# Altium project ESP32-DCU-Rev1.PrjPcb (part 1 of 2)
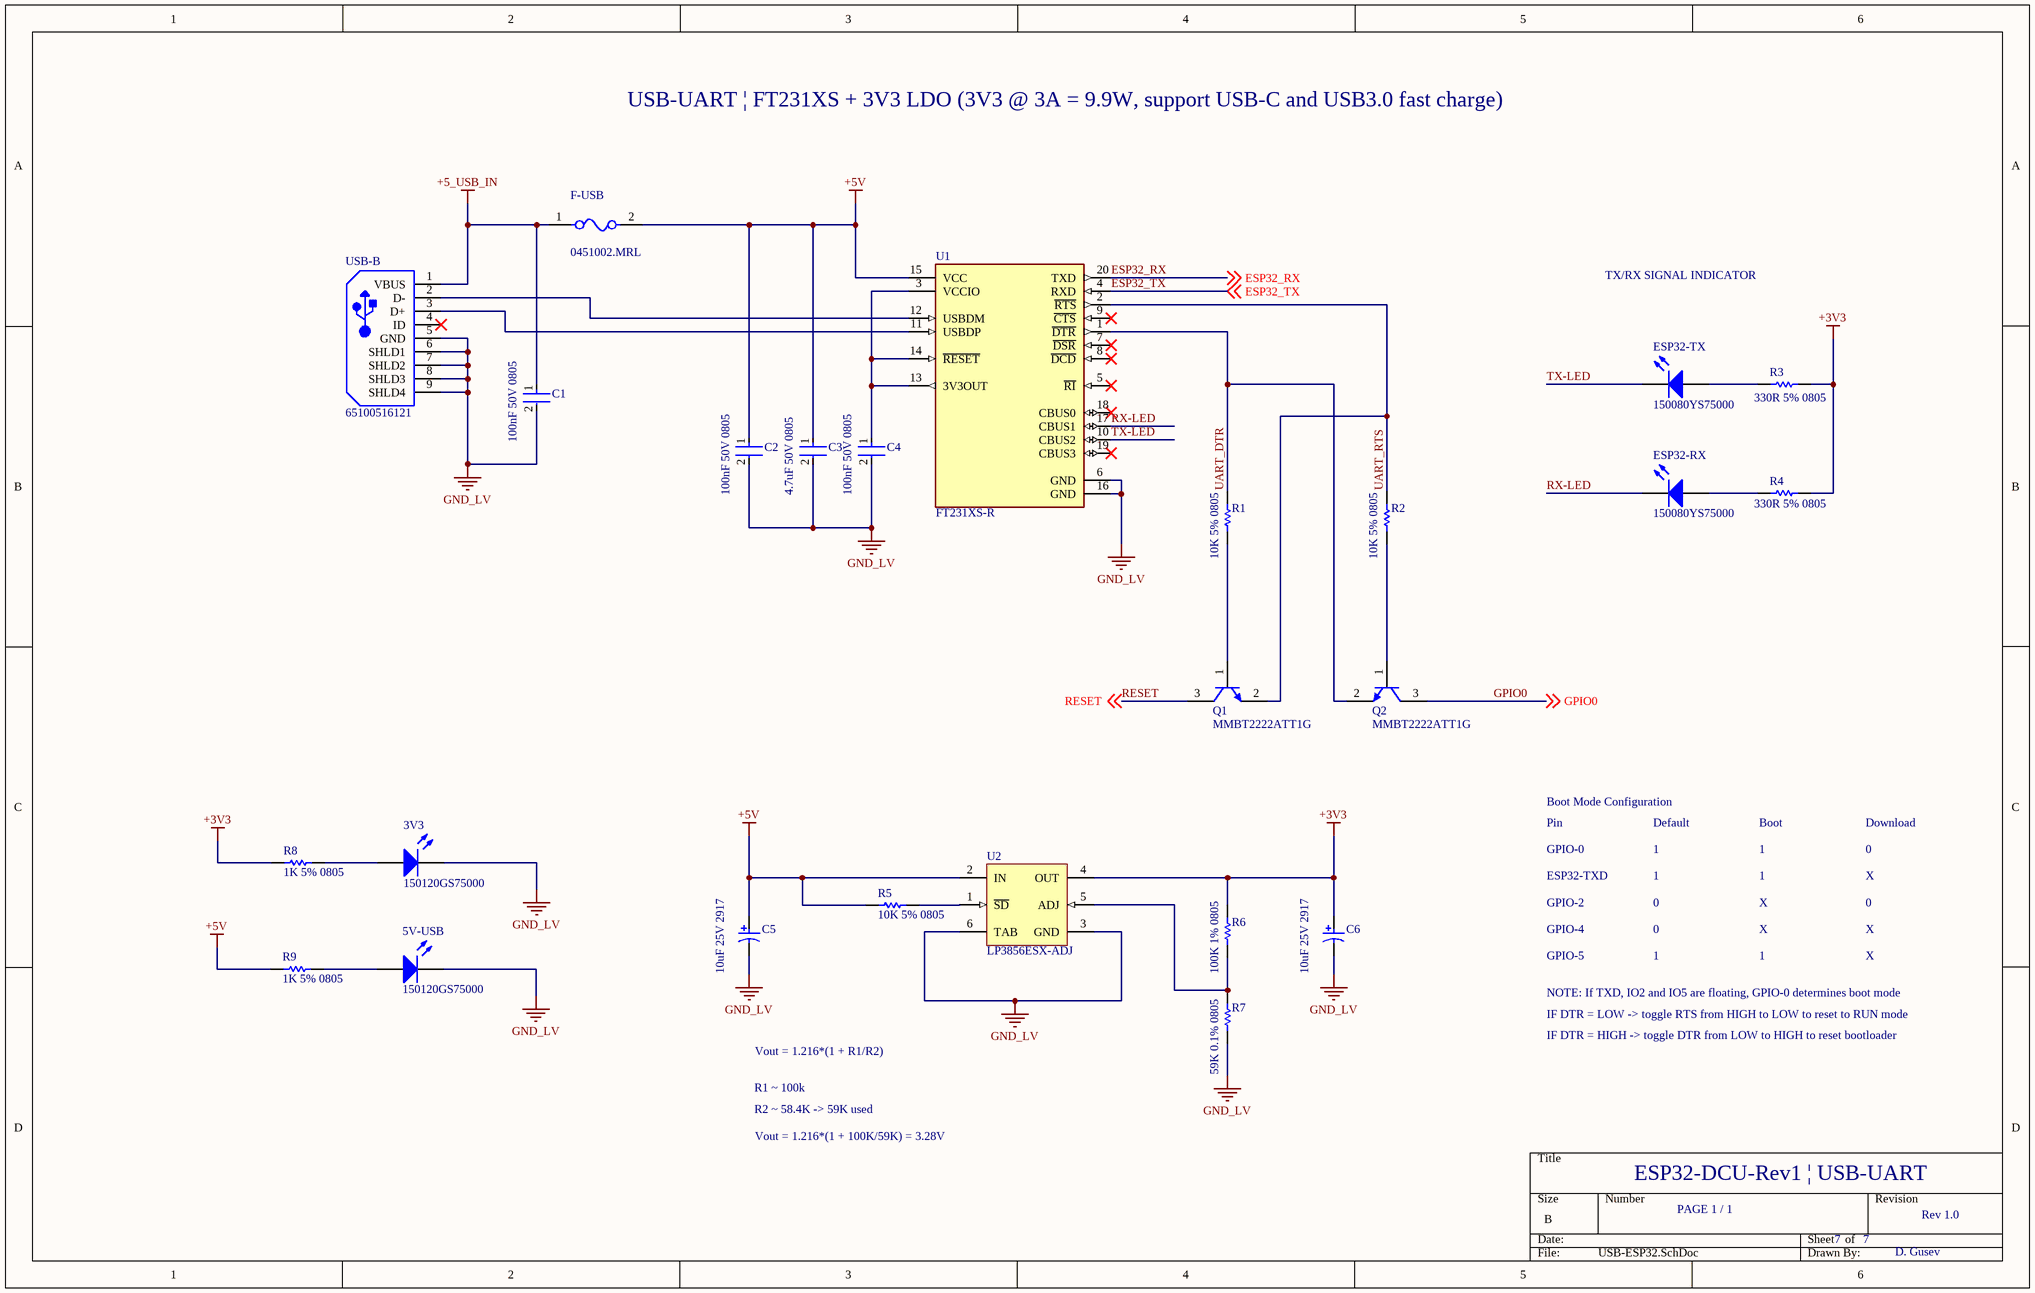
[diagram p0: USB-ESP32.SchDoc]
10 sheets, 162 parts. Net scope: global (net labels, ports and power ports of the same name join across sheets).
Sheets:
  USB-ESP32.SchDoc
  ESP32.SchDoc
  USB-HOST.SchDoc
  Ethernet.SchDoc
  MCP23017.SchDoc
  TCA9548A.SchDoc
  DCU1.SchDoc
  RELAYS.SchDoc
  POWER.SchDoc
  CONN.SchDoc

## Sheet USB-ESP32.SchDoc
size B

### Parts
3V3  150120GS75000  [1206_A]
5V-USB  150120GS75000  [1206_A]
C1  100nF 50V 0805  [FP-C0805C-DN-MFG]
C2  100nF 50V 0805  [FP-C0805C-DN-MFG]
C3  4.7uF 50V 0805  [FP-C2012-125-MFG]
C4  100nF 50V 0805  [FP-C0805C-DN-MFG]
C5  10uF 25V 2917  [KEMT-T491-D_L]
C6  10uF 25V 2917  [KEMT-T491-D_L]
ESP32-RX  150080YS75000  [0805_A]
ESP32-TX  150080YS75000  [0805_A]
F-USB  0451002.MRL  [FP-0451-MFG]
Q1  MMBT2222ATT1G  [ONSC-SC-75-3-463-01_V]
Q2  MMBT2222ATT1G  [ONSC-SC-75-3-463-01_V]
R1  10K 5% 0805  [RESC2013X60X40ML20T25]
R2  10K 5% 0805  [RESC2013X60X40ML20T25]
R3  330R 5% 0805  [RESC2013X60X40ML20T25]
R4  330R 5% 0805  [RESC2013X60X40ML20T25]
R5  10K 5% 0805  [RESC2013X60X40ML20T25]
R6  100K 1% 0805  [RESC2013X60X35ML10T20]
R7  59K 0.1% 0805  [RESC2013X60X35NL10T20]
R8  1K 5% 0805  [RESC2013X60X40ML20T25]
R9  1K 5% 0805  [RESC2013X60X40ML20T25]
U1  FT231XS-R  [FP-SSOP-20-MFG]
U2  LP3856ESX-ADJ  [TS5B_M]
USB-B  65100516121  [WE-65100516121_V]

### Nets
+3V3: C6.1 R3.1 R4.1 R6.2 R8.2 U2.4(OUT)  [project net VDD33]
+5_USB_IN: C1.1 F-USB.1 USB-B.1(VBUS)
+5V: C2.1 C3.1 C5.1 F-USB.2 R5.2 R9.2 U1.15(VCC) U2.2(IN)
GND_LV: 3V3.1(K) 5V-USB.1(K) C1.2 C2.2 C3.2 C4.2 C5.2 C6.2 R7.1 U1.6(GND) U1.16(GND) U2.3(GND) U2.6(TAB) USB-B.5(GND) USB-B.6(SHLD1) USB-B.7(SHLD2) USB-B.8(SHLD3) USB-B.9(SHLD4)
ESP32_RX: U1.20(TXD) ; off-sheet ESP32_RX
ESP32_TX: U1.4(RXD) ; off-sheet ESP32_TX
GPIO0: Q2.3(C) ; off-sheet GPIO0
RESET: Q1.3(C) ; off-sheet RESET
RX-LED: ESP32-RX.1(K) U1.17(CBUS1)
TX-LED: ESP32-TX.1(K) U1.10(CBUS2)
UART_DTR: Q2.2(E) R1.2 U1.1(~{DTR})
UART_RTS: Q1.2(E) R2.2 U1.2(~{RTS})
Net3V3_2: 3V3.2(A) R8.1
Net5V-USB_2: 5V-USB.2(A) R9.1
NetC4_1: C4.1 U1.3(VCCIO) U1.13(3V3OUT) U1.14(~{RESET})
NetESP32-RX_2: ESP32-RX.2(A) R4.2
NetESP32-TX_2: ESP32-TX.2(A) R3.2
NetQ1_1: Q1.1(B) R1.1
NetQ2_1: Q2.1(B) R2.1
NetR5_1: R5.1 U2.1(~{SD})
NetR6_1: R6.1 R7.2 U2.5(ADJ)
NetU1_11: U1.11(USBDP) USB-B.3(D+)
NetU1_12: U1.12(USBDM) USB-B.2(D-)

Not connected (* = marked no-connect by the designer): U1 5(~{RI})* 7(~{DSR})* 8(~{DCD})* 9(~{CTS})* 18(CBUS0)* 19(CBUS3)*; USB-B 4(ID)*

### Notes on the sheet
- USB-UART | FT231XS + 3V3 LDO (3V3 @ 3A = 9.9W, support USB-C and USB3.0 fast charge)
- TX/RX SIGNAL INDICATOR
- Boot Mode Configuration
- Pin
- Default
- Boot
- Download
- GPIO-0
- ESP32-TXD
- GPIO-2
- 1
- 0
- X
- GPIO-4
- GPIO-5
- NOTE: If TXD, IO2 and IO5 are floating, GPIO-0 determines boot mode
- IF DTR = LOW -> toggle RTS from HIGH to LOW to reset to RUN mode
- IF DTR = HIGH -> toggle DTR from LOW to HIGH to reset bootloader
- R1 ~ 100k
- R2 ~ 58.4K -> 59K used
- Vout = 1.216*(1 + R1/R2)
- Vout = 1.216*(1 + 100K/59K) = 3.28V
- ESP32-DCU-Rev1 | USB-UART
- PAGE 1 / 1
- 7
- Rev 1.0
- D. Gusev

### Library data of the parts
3V3 5V-USB = CMP-1426-00014-1: SMD mono-color Chip LED, WL-SMCW, Green; Manufacturer: Wuerth Elektronik; PackageReference: 1206_A; PartNumber: 150120GS75000; ComponentLink1Description: Manufacturer URL; ComponentLink2URL: http://katalog.we-online.com/led/datasheet/150120GS75000.pdf; ComponentLink2Description: Datasheet; Color: Green; ComponentLink1URL: http://www.we-online.com
C1 C2 C4 = CMP-2007-00279-2: CAP CER 0.1UF 50V X7R 0805; Manufacturer Part Number: C0805C104K5RACTU; Manufacturer: KEMET; Value: 0.10 μF; Tolerance: 0.1; Temperature Coefficient: 30ppm/°C; Material: Ceramic; Device Class L2: Capacitors; Temperature Range Low: -55°C; Voltage Rating: 50 V; Digikey Description: CAP CER 0.1UF 50V X7R 0805; Category: Cap; ComponentLink2Description: Datasheet; Octopart: https://octopart.com/c0805c104k5ractu-kemet-143926; RoHS: TRUE; ComponentLink2URL: https://content.kemet.com/datasheets/KEM_C1003_C0G_SMD.pdf; Temperature Characteristic: X7R; Temperature: -55°C to +125°C; Height: 0.88mm; Temperature Range High: +125°C; Device Class L1: Passive Components; Automotive: No; Lead Free: Yes; Ipc Land Pattern Name: CAPC200125X78; Device Class L3: Ceramic Capacitors; Mouser Description: Cap Ceramic 0.1uF 50V X7R 10% SMD 2.0 x 1.2 mm 125 C Paper T/R; Capacitance: 0.10 μF; Package: C0805C-DN
C3 = CMP-08246-000007-1: CAP CER 4.7UF 50V X5R 0805; Manufacturer Part Number: C2012X5R1H475K125AB; Manufacturer: TDK Corporation; Tolerance: 10%; Temperature Coefficient: 15%; Material: Ceramic; Mouser Description: Multilayer Ceramic Capacitors MLCC - SMD/SMT 0805 4.7uF 50volts X5R 10%; Category: Cap; Temperature Range High: +85°C; Digikey Description: CAP CER 4.7UF 50V X5R 0805; Voltage Rating: 50V; Device Class L1: Passive Components; Temperature Range Low: -55°C; Lead Free: Yes; ComponentLink2Description: Datasheet; Capacitance: 4.7uF; Octopart: https://octopart.com/c2012x5r1h475k125ab-tdk-25947720; Device Class L2: Capacitors; Value: 4.7uF; Temperature: -55°C to +85°C; ComponentLink2URL: https://product.tdk.com/info/en/catalog/datasheets/mlcc_commercial_general_en.pdf; RoHS: TRUE; Height: 1.45mm; Temperature Characteristic: X5R; Package: C2012-125; Device Class L3: Ceramic Capacitors; Automotive: No
C5 C6 = CMP-2000-07200-1: Tantalum Capacitor, 10 uF, +/- 10%, 25 V, -55 to 125 degC, 2-Pin SMD, RoHS, Tape and Reel; Manufacturer: Kemet; Insulation: NotRequired; Rad Hardened: No; Case Style: Molded; Polarity: Polar; Product Height (mm): 2.8mm; Capacitance: 10000000pF; Product Length (mm): 7.3mm; DF: 6%; ESR: 1ohm; Product Diameter (mm): NotRequiredmm; Voltage: 25VDC; Product Depth (mm): 4.3mm; DCL: 2.5uA; Mounting Style: SurfaceMount; Construction: SMTChip; Failure Rate: NotRequired; Operating Temp Range: -55Cto125C; Packaging: TapeandReel; Length W/Weld: NotRequiredmm; Package Reference: T491-D; Datasheet Version: 10/2016; Package / Case: 7343-31; Wire Form: NotRequired; Seated Plane Height: NotRequiredmm; Length W/Weld (max): NotRequiredmm; Package Description: 2-Pin Surface Mount Device, Body 7.3 x 4.3 mm; Tolerance (+ or -): 10%; Manufacturer URL: http://www.kemet.com/; Datasheet URL: http://capacitoredge.kemet.com/capedge2/DataSheet/Datasheet-T491D106K025AT.pdf?pn=T491D106K025AT; Case Code: D; Mounting Technology: SurfaceMount; Seal: NotRequired; Lead Spacing (nom): NotRequiredmm
ESP32-RX ESP32-TX = CMP-1426-00012-1: SMD mono-color Chip LED, WL-SMCW, Yellow; Manufacturer: Wuerth Elektronik; Color: Yellow; ComponentLink1URL: http://www.we-online.com; PackageReference: 0805_A; ComponentLink2URL: http://katalog.we-online.com/led/datasheet/150080YS75000.pdf; ComponentLink1Description: Manufacturer URL; ComponentLink2Description: Datasheet; PartNumber: 150080YS75000
F-USB = CMP-08605-000053-1: FUSE BOARD MNT 2A 125VAC/VDC SMD; Manufacturer: Littelfuse; Max Fuse Dc Voltage: 125V; Value: 0.0367Ω; Fuse Interrupt Ac Current: 50A; Fuse I2T: 0.53A2Sec; Fuse Blow Speed: Fast; Device Class L2: Fuses; Temperature Range High: +125°C; Category: Fuse; ComponentLink2URL: https://www.littelfuse.com/~/media/electronics/datasheets/fuses/littelfuse_fuse_451_453_datasheet.pdf.pdf; Automotive: No; Temperature Range Low: -55°C; Voltage Rating: 125V; ComponentLink2Description: Datasheet; Temperature: -55°C to +125°C; Device Class L3: unset; Height: 2.94mm; Lead Free: Yes; Resistance: 0.0367Ω; Max Fuse Ac Voltage: 125V; Fuse Interrupt Dc Current: 50A; RoHS: TRUE; Fuse Current: 2A; Digikey Description: FUSE BOARD MNT 2A 125VAC/VDC SMD; Device Class L1: Circuit Protection; Octopart: https://octopart.com/0451002.mrl-littelfuse-566376; Mouser Description: Surface Mount Fuses 125V 2A; Package: 0451; Manufacturer Part Number: 0451002.MRL
Q1 Q2 = CMP-1048-00417-1: General Purpose Transistor, NPN Silicon, 3-Pin SC-75, Pb-Free, Tape and Reel; Manufacturer: On Semiconductor; IC Continuous (A): 0.6; fT Min (MHz): 300; DatasheetVersion: Rev. 5; PackageVersion: Rev. F, 07/2005; ComponentLink1Description: Manufacturer URL; RoHS: TRUE; Packing: Tape and Reel; ComponentLink3URL: http://www.onsemi.com/pub_link/Collateral/463-01.PDF; ComponentLink1URL: http://www.onsemi.com/; ComponentLink3Description: Package Specification; ComponentLink2URL: http://www.onsemi.cn/pub_link/Collateral/MMBT2222ATT1-D.PDF; Mounting Technology: Surface Mount; PartNumber: MMBT2222ATT1G; ComponentLink2Description: Datasheet; Polarity: NPN; PackageReference: SC-75-3-463-01; PackageDescription: 3-Pin Small Outline Transistor, Body 1.6 x 0.8 mm, Pitch 0.5 mm
R1-R5 R8 R9 = CMP-2001-00590-1: Part Number: ERA6AEB123V; Manufacturer: Panasonic
R6 = CMP-2100-03668-1: Chip Resistor, 100 KOhm, +/- 1%, 0.125 W, -55 to 155 degC, 0805 (2012 Metric), RoHS, Tape and Reel; Manufacturer: Yageo; Max Power Dissipation: 125mW; Voltage Rating: 150V; Temperature Coefficient: 100ppm/degreesC; Manufacturer URL: http://www.yageo.com/; Min Operating Temperature: -55degC; Lead Pitch: 0.4mm; Composition: ThickFilm; Case Code (Metric): 2012; Military Standard: Not; Package Description: 2-Pin Surface Mounted Device, Body 2 x 1.25 mm; REACH SVHC: Unknown; RoHSCompliant: true; Depth: 1.25mm; Number of Pins: 2; Lead Free: LeadFree; Resistance: 100KOhm; Datasheet URL: http://www.yageo.com/NewPortal/yageodocoutput?fileName=/pdf/R-Chip/PYu-RC_Group_51_RoHS_L_5.pdf; Max Operating Temperature: 155degC; Case/Package: 0805; Package Quantity: 1; Case Code (Imperial): 0805; Power Rating: 125mW; Width: 0.049inch; Package Reference: 0805; Height: 0.024inch; Termination: SMD/SMT; Tolerance: 1%; Datasheet Version: Rev. 5, 10/2016; Length: 2mm; Voltage Rating (DC): 150V; Number of Terminations: 2; Packaging: TapeandReel
R7 = CMP-2001-01205-1: Part Number: RC0805FR-0759KL; Manufacturer: Yageo
U1 = CMP-0248-00024-3: IC USB SERIAL FULL UART 20SSOP; Operating Supply Voltage: 5V; Operating Supply Current: 8mA; Number of Channels: 1; Min Supply Voltage: 2.97V; Max Supply Voltage: 5.5V; Data Rate: 12Mbps; Height: 0.059inch; Packaging: Tape and Reel; Mount: Surface Mount; Package Quantity: 2000; Radiation Hardening: No; Case/Package: SSOP; Min Operating Temperature: -40°C; Width: 0.157inch; Number of Pins: 20; Weight: 0.016oz; Interface: UART; Max Operating Temperature: 85°C; Length: 8.74mm
U2 = CMP-0062-00133-2: 3A Fast Ultra Low Dropout Linear Regulator, 5-pin TO-263; Manufacturer: National Semiconductor; PackageTopMarking: NSUZXYTTE#*LP3856ES*-ADJ; PowerWise: N; CompType: LDO IC; PackageDescription: TO-263, Molded, .400 x .390 x .180in, 5 Lead, .067in Pitch, Surface Mount; RevisionNote: Component URLs added; ComponentLink1URL: http://www.national.com/ds/LP/LP3856-ADJ.pdf; PinCount: 5; ComponentLink2URL: http://www.national.com/pf/LP/LP3856.html; Code_JEDEC: MO-169-AB; PackageVersion: revD, Apr-2005; PackageReference: TS5B; DatasheetVersion: Sep-2006; ComponentLink1Description: LP3856 Datasheet; ComponentLink3Description: TS5B Package Page; ComponentLink3URL: http://www.national.com/packaging/folders/ts5b.html; ComponentLink2Description: LP3856 Web Page; RoHS: N
USB-B = CMP-2000-05576-1: MINI USB 2.0 SMT Type B 5 Contacts, 30 V, -40 to 105 degC, RoHS, Tape and Reel; Manufacturer: Wuerth Elektronik; Package Description: 5-Pin Surface Mount Device, Body 9.6 x 9.25 mm, Pitch 0.8 mm; Mounting Technology: SurfaceMount; Package Reference: 65100516121; Manufacturer URL: https://www.we-online.com/; Datasheet Version: Rev. H, 02/2013; Datasheet URL: https://datasheet.ciiva.com/4598/65100516121-83749-4598775.pdf

## Sheet ESP32.SchDoc
size B
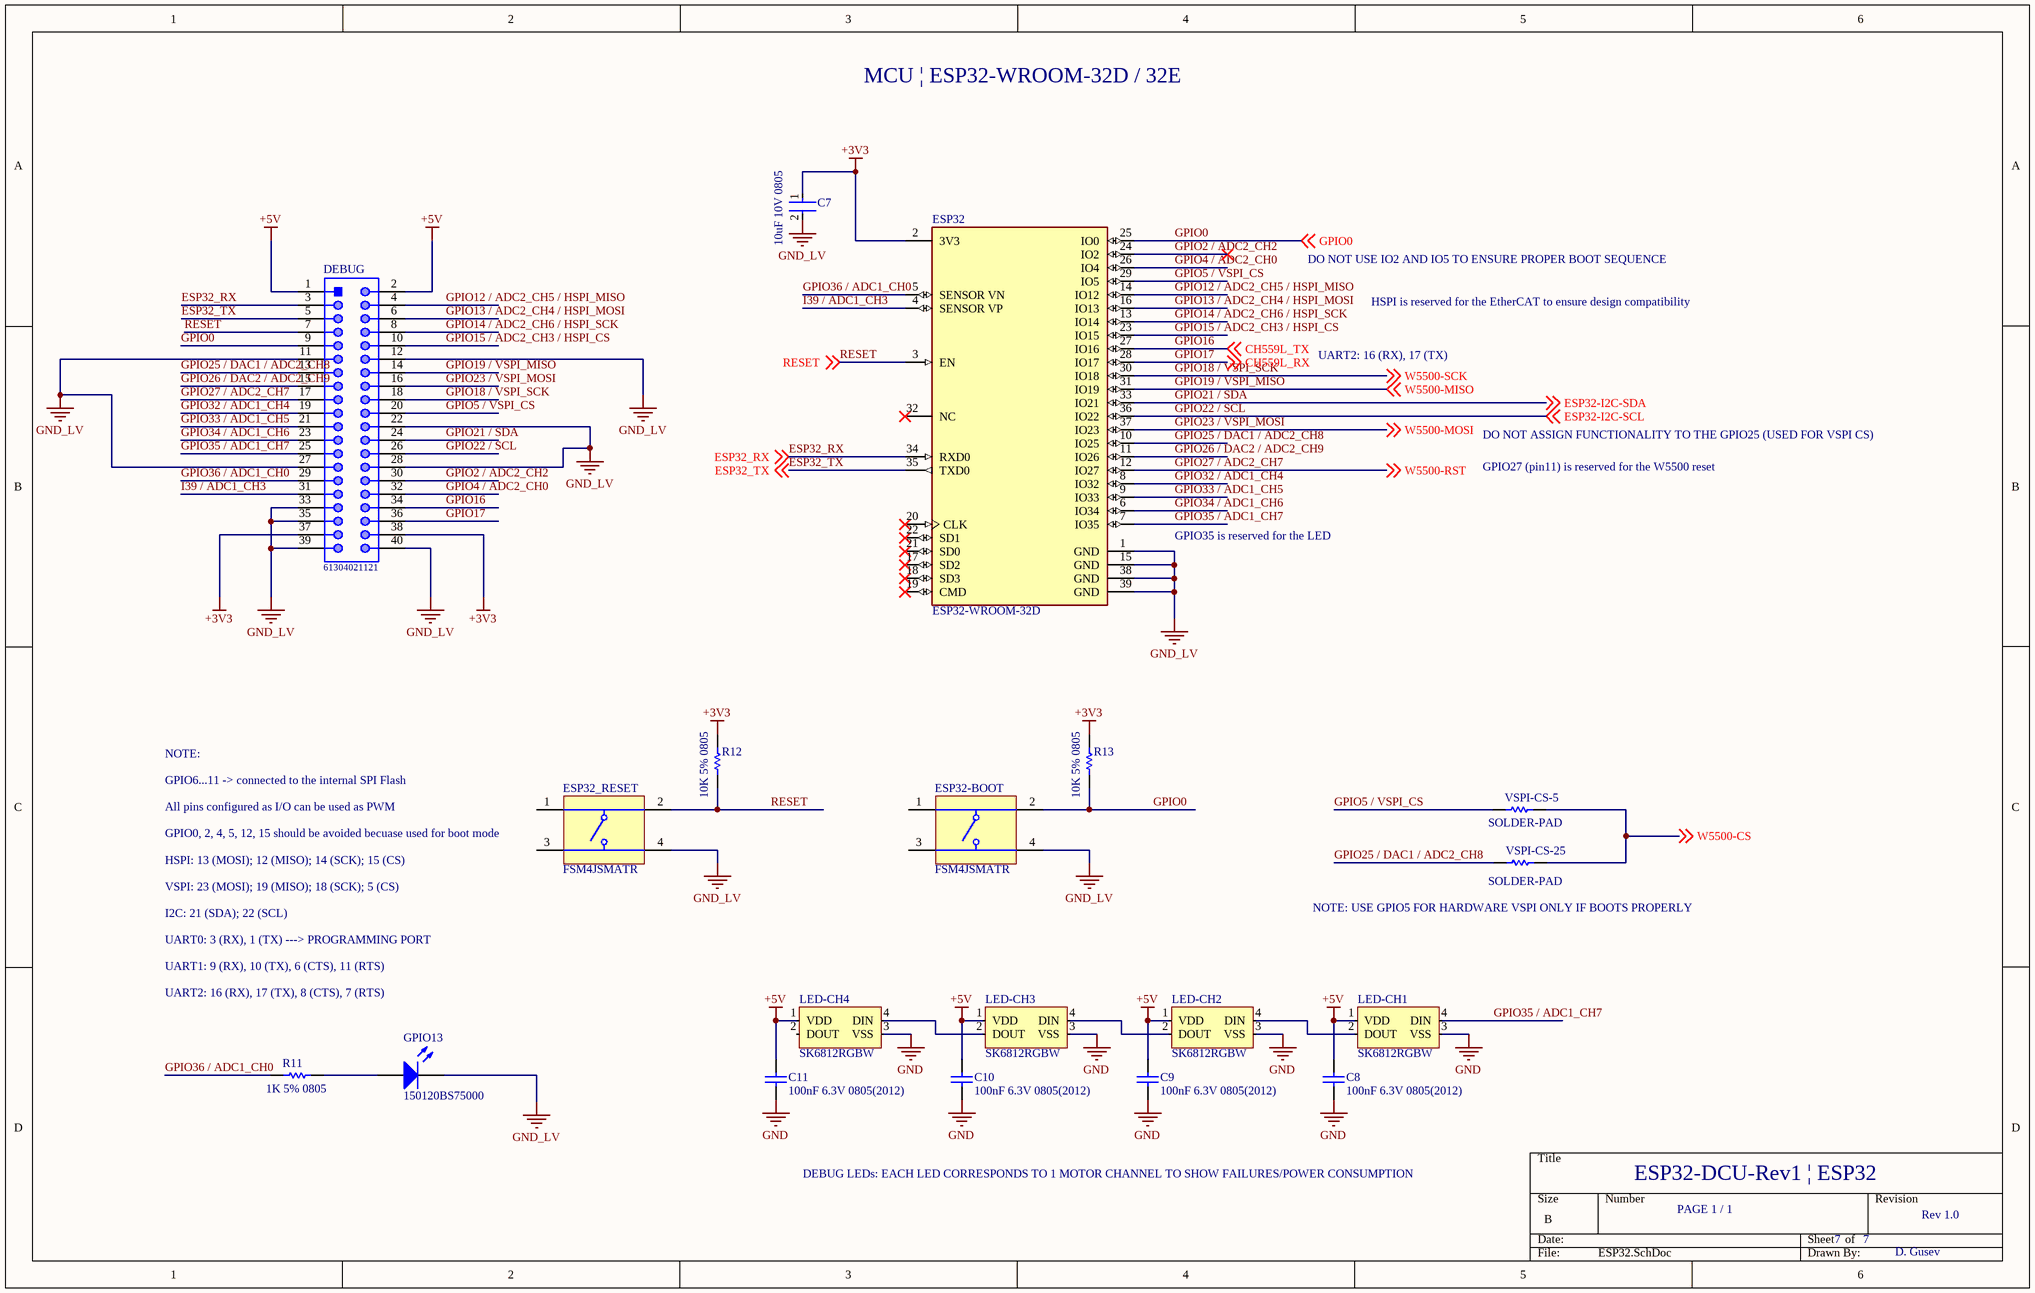
[diagram p1: ESP32.SchDoc]

### Parts
C7  10uF 10V 0805  [FP-C0805C-DG-MFG]
C8  100nF 6.3V 0805(2012)  [CAPC0805(2012)100_N]
C9  100nF 6.3V 0805(2012)  [CAPC0805(2012)100_N]
C10  100nF 6.3V 0805(2012)  [CAPC0805(2012)100_N]
C11  100nF 6.3V 0805(2012)  [CAPC0805(2012)100_N]
DEBUG  61304021121  [61304021121]
ESP32  ESP32-WROOM-32D  [FP-ESP32-WROOM-32D-MFG]
ESP32-BOOT  FSM4JSMATR  [TECO-FSM4JSMATR_V]
ESP32_RESET  FSM4JSMATR  [TECO-FSM4JSMATR_V]
GPIO13  150120BS75000  [1206_A]
LED-CH1  SK6812RGBW  [SK6812RGBW]
LED-CH2  SK6812RGBW  [SK6812RGBW]
LED-CH3  SK6812RGBW  [SK6812RGBW]
LED-CH4  SK6812RGBW  [SK6812RGBW]
R11  1K 5% 0805  [RESC2013X60X40ML20T25]
R12  10K 5% 0805  [RESC2013X60X40ML20T25]
R13  10K 5% 0805  [RESC2013X60X40ML20T25]
VSPI-CS-5  SOLDER-PAD  [RESC2013X60X35LL10T20]
VSPI-CS-25  SOLDER-PAD  [RESC2013X60X35LL10T20]

### Nets
+3V3: C7.1 DEBUG.37 DEBUG.38 ESP32.2(3V3) R12.2 R13.2  [project net VDD33]
+5V: C8.2 C9.2 C10.2 C11.2 DEBUG.1 DEBUG.2 LED-CH1.1(VDD) LED-CH2.1(VDD) LED-CH3.1(VDD) LED-CH4.1(VDD)
GND: C8.1 C9.1 C10.1 C11.1 LED-CH1.3(VSS) LED-CH2.3(VSS) LED-CH3.3(VSS) LED-CH4.3(VSS)
GND_LV: C7.2 DEBUG.11 DEBUG.12 DEBUG.22 DEBUG.27 DEBUG.28 DEBUG.33 DEBUG.35 DEBUG.39 DEBUG.40 ESP32.1(GND) ESP32.15(GND) ESP32.38(GND) ESP32.39(GND) ESP32-BOOT.4 ESP32_RESET.4 GPIO13.1(K)
ESP32_RX: DEBUG.3 ESP32.34(RXD0) ; off-sheet ESP32_RX
ESP32_TX: DEBUG.5 ESP32.35(TXD0) ; off-sheet ESP32_TX
GPIO0: DEBUG.9 ESP32.25(IO0) ESP32-BOOT.2 R13.1 ; off-sheet GPIO0
GPIO2 / ADC2_CH2: DEBUG.30 ESP32.24(IO2)
GPIO4 / ADC2_CH0: DEBUG.32 ESP32.26(IO4)
GPIO5 / VSPI_CS: DEBUG.20 ESP32.29(IO5) VSPI-CS-5.1
GPIO12 / ADC2_CH5 / HSPI_MISO: DEBUG.4 ESP32.14(IO12)
GPIO13 / ADC2_CH4 / HSPI_MOSI: DEBUG.6 ESP32.16(IO13)
GPIO14 / ADC2_CH6 / HSPI_SCK: DEBUG.8 ESP32.13(IO14)
GPIO15 / ADC2_CH3 / HSPI_CS: DEBUG.10 ESP32.23(IO15)
GPIO16: DEBUG.34 ESP32.27(IO16) ; off-sheet CH559L_TX  [also labelled CH559L_TX]
GPIO17: DEBUG.36 ESP32.28(IO17) ; off-sheet CH559L_RX  [also labelled CH559L_RX]
GPIO18 / VSPI_SCK: DEBUG.18 ESP32.30(IO18) ; off-sheet W5500-SCK  [also labelled W5500-SCK]
GPIO19 / VSPI_MISO: DEBUG.14 ESP32.31(IO19) ; off-sheet W5500-MISO  [also labelled W5500-MISO]
GPIO21 / SDA: DEBUG.24 ESP32.33(IO21) ; off-sheet ESP32-I2C-SDA  [also labelled ESP32-I2C-SDA]
GPIO22 / SCL: DEBUG.26 ESP32.36(IO22) ; off-sheet ESP32-I2C-SCL  [also labelled ESP32-I2C-SCL]
GPIO23~{ }/ VSPI_MOSI: DEBUG.16 ESP32.37(IO23) ; off-sheet W5500-MOSI  [also labelled W5500-MOSI]
GPIO25 / DAC1 / ADC2_CH8: DEBUG.13 ESP32.10(IO25) VSPI-CS-25.1
GPIO26 / DAC2 / ADC2_CH9: DEBUG.15 ESP32.11(IO26)
GPIO27 / ADC2_CH7: DEBUG.17 ESP32.12(IO27) ; off-sheet W5500-RST  [also labelled W5500-RST]
GPIO32 / ADC1_CH4: DEBUG.19 ESP32.8(IO32)
GPIO33 / ADC1_CH5: DEBUG.21 ESP32.9(IO33)
GPIO34 / ADC1_CH6: DEBUG.23 ESP32.6(IO34)
GPIO35 / ADC1_CH7: DEBUG.25 ESP32.7(IO35) LED-CH1.4(DIN)
GPIO36 / ADC1_CH0: DEBUG.29 ESP32.5(SENSOR_VN) R11.1
I39 / ADC1_CH3: DEBUG.31 ESP32.4(SENSOR_VP)
RESET: DEBUG.7 ESP32.3(EN) ESP32_RESET.2 R12.1 ; off-sheet RESET
W5500-CS: VSPI-CS-5.2 VSPI-CS-25.2 ; off-sheet W5500-CS  [project net SCSn]
NetGPIO13_2: GPIO13.2(A) R11.2
NetLED-CH1_2: LED-CH1.2(DOUT) LED-CH2.4(DIN)
NetLED-CH2_2: LED-CH2.2(DOUT) LED-CH3.4(DIN)
NetLED-CH3_2: LED-CH3.2(DOUT) LED-CH4.4(DIN)

Not connected (* = marked no-connect by the designer): ESP32 17(SD2)* 18(SD3)* 19(CMD)* 20(CLK)* 21(SD0)* 22(SD1)* 32(NC)*; ESP32-BOOT 1 3; ESP32_RESET 1 3; LED-CH4 2(DOUT)

### Notes on the sheet
- MCU | ESP32-WROOM-32D / 32E
- DO NOT USE IO2 AND IO5 TO ENSURE PROPER BOOT SEQUENCE
- UART2: 16 (RX), 17 (TX)
- HSPI is reserved for the EtherCAT to ensure design compatibility
- DO NOT ASSIGN FUNCTIONALITY TO THE GPIO25 (USED FOR VSPI CS)
- GPIO27 (pin11) is reserved for the W5500 reset
- GPIO35 is reserved for the LED
- NOTE:
- GPIO6...11 -> connected to the internal SPI Flash
- All pins configured as I/O can be used as PWM
- (near ESP32_RESET) GPIO0, 2, 4, 5, 12, 15 should be avoided becuase used for boot mode
- HSPI: 13 (MOSI); 12 (MISO); 14 (SCK); 15 (CS)
- VSPI: 23 (MOSI); 19 (MISO); 18 (SCK); 5 (CS)
- (near VSPI-CS-25) NOTE: USE GPIO5 FOR HARDWARE VSPI ONLY IF BOOTS PROPERLY
- I2C: 21 (SDA); 22 (SCL)
- UART0: 3 (RX), 1 (TX) ---> PROGRAMMING PORT
- UART1: 9 (RX), 10 (TX), 6 (CTS), 11 (RTS)
- UART2: 16 (RX), 17 (TX), 8 (CTS), 7 (RTS)
- DEBUG LEDs: EACH LED CORRESPONDS TO 1 MOTOR CHANNEL TO SHOW FAILURES/POWER CONSUMPTION
- ESP32-DCU-Rev1 | ESP32
- PAGE 1 / 1
- 7
- Rev 1.0
- D. Gusev

### Library data of the parts
C7 = CMP-2007-03243-2: CAP CER 10UF 10V X5R 0805; Manufacturer Part Number: C0805C106K8PACTU; Manufacturer: Kemet; 3DS Part Number: 220-00001; Tolerance: 10%; Temperature Coefficient: 15%; Material: Ceramic; Device Class L2: Capacitors; Device Class L1: Passive Components; ComponentLink2URL: https://content.kemet.com/datasheets/KEM_C1006_X5R_SMD.pdf; Height: 1.4mm; Lead Free: Yes; Digikey Description: CAP CER 10UF 10V X5R 0805; Octopart: https://octopart.com/c0805c106k8pactu-kemet-98697; Capacitance: 10uF; Value: 10uF; Temperature Range Low: -55°C; Temperature: -55°C to +85°C; Automotive: No; Mouser Description: CAP CER 10UF 10V X5R 0805; Ipc Land Pattern Name: CAPC200125X125; Temperature Range High: +85°C; Voltage: 10V; RoHS: TRUE; Device Class L3: Ceramic Capacitors; ComponentLink2Description: Datasheet; Voltage Rating: 10V; Package: C0805C-DG; Temperature Characteristic: X5R; Category: Cap
C8-C11 = CMP-1036-04392-1: CAP 100nF 6.3V ±20% 0805 (2012 Metric) Thickness 1mm SMD; Tolerance: Â±20%; Case-Metric: 2012; Case-EIA: 0805; Max Thickness: 1 mm; Technology: SMT; Value: 100nF; Rated Voltage: 6.3 V
DEBUG = CMP-1502-01135-1: THT Vertical Pin Header WR-PHD, Pitch 2.54 mm, Dual Row, 40 pins; Manufacturer: Wurth Elektronik; Contact Resistance: 20mOhm; Pitch: 2.54mm; Pin Number: 40; Withstanding Voltage: 500VAC; Gender: Male; Rated Current: 3A; Working Voltage: 250VAC; Operating Temperature: -40to105degC; Manufacturer URL: http://www.we-online.de; Orientation: Vertical; Datasheet URL: https://katalog.we-online.de/em/datasheet/6130xx21121.pdf; Package Reference: 61304021121; Row Number: Dual; Part Number: 61304021121; Packaging: Bag; Mounting Technology: THT; Publisher: WurthElektronik
ESP32 = CMP-194065-000003-1: WIFI MODULE 32MBITS SPI FLASH; Manufacturer: Espressif Systems; Max Supply Voltage: 3.6V; Nominal Supply Current: 500mA; Max Frequency: 2484MHz; Number Of Adc Channels: 16; Number Of Gpio: 32; Interface: I2C,SPI,UART,Ethernet,I2S,Other; Data Rate: 150Mbits/s; Min Supply Voltage: 3V; Bandwidth: 72MHz; Sensitivity: -98dBm; Octopart: https://octopart.com/esp32-wroom-32d-espressif+systems-91040050; Package: ESP32-WROOM-32D; ComponentLink2URL: https://www.espressif.com/sites/default/files/documentation/esp32-wroom-32d_esp32-wroom-32u_datasheet_en.pdf; Lead Free: Yes; Category: UNK; Mouser Description: Wi-Fi/BT BLE Module ESP32-D0WD, SPI Flash, UART, P; Device Class L1: Integrated Circuits (ICs); RoHS: TRUE; Temperature Range Low: -40°C; ComponentLink2Description: Datasheet; Digikey Description: WIFI MODULE 32MBITS SPI FLASH; Height: 3.2mm; Temperature: -40°C to +85°C; Manufacturer Part Number: ESP32-WROOM-32D; Device Class L3: Transceivers; Device Class L2: RF Semiconductors and Devices; Temperature Range High: +85°C; Automotive: No
ESP32-BOOT ESP32_RESET = CMP-2000-07486-1: Micro Miniature Push Button Switch FSM JSM, 50 mA, -35 to 85 degC, 4-Pin SMD, RoHS, Tape and Reel; Manufacturer: TE Connectivity; Mechanical Life: 100000Cycles; Current Rating: 50mA; Actuator Material: Polyamide; Max Voltage Rating (DC): 12V; Capacitance: 0f; Illumination Type: Illuminated; Voltage Rating (DC): 24V; Case\/Package: SMD/SMT; Operating Force: 160gf; Contact Resistance: 100mOhm; Actuator Length: 0.055inch; Switch Travel: 0.25mm; Throw Configuration: SPST; Termination: GullWing; Contact Plating: Silver; Orientation: Straight; Mounting Technology: SurfaceMount; REACH SVHC: Unknown; Electrical Life: 100000Cycles; Package Reference: FSM4JSMATR; Max Operating Temperature: 85degC; Manufacturer URL: http://www.te.com/; Package Description: 4-Pin Surface Mount Device, Body 6 x 6 mm, Pitch 4.5 mm; Datasheet Version: Rev. V, 02/2015; Packaging: TapeandReel; Min Operating Temperature: -35degC; Mount: SurfaceMount; Contact Current Rating: 50mA; Contact Material: CopperAlloy; Package Quantity: 1200; Datasheet URL: http://www.te.com/commerce/DocumentDelivery/DDEController?Action=showdoc&DocId=Customer+Drawing%7F2-1437565-7%7FV%7Fpdf%7FEnglish%7FENG_CD_2-1437565-7_V.pdf%7F4-1437565-2; RoHSCompliant: true
GPIO13 = CMP-1426-00015-1: SMD mono-color Chip LED, WL-SMCW, Blue; Manufacturer: Wuerth Elektronik; ComponentLink2Description: Datasheet; ComponentLink1URL: http://www.we-online.com; PartNumber: 150120BS75000; ComponentLink1Description: Manufacturer URL; ComponentLink2URL: http://katalog.we-online.com/led/datasheet/150120BS75000.pdf; PackageReference: 1206_A; Color: Blue
R11-R13 = CMP-2001-00590-1: as R1 on sheet USB-ESP32
VSPI-CS-5 VSPI-CS-25 = CMP-1659-00014-4: Chip Resistor, 1 Ohm, +/- 1%, 125 mW, -55 to 155 degC, 0805 (2012 Metric), RoHS, Tape and Reel; Manufacturer: Yageo; Voltage Rating: 150 V; REACH SVHC: No SVHC; Mounting Technology: Surface Mount; RoHSCompliant: true; Packaging: Tape and Reel; ComponentLink2URL: http://www.yageo.com/documents/recent/PYu-RC_Group_51_RoHS_L_04.pdf; Pins: 2; Package Quantity: 5000; DatasheetVersion: Rev. 4, 02/2016; Mount: Surface Mount; Max Operating Temperature: 155 degC; PackageDescription: 2-Pin Surface Mounted Device, Body 2 x 1.25 mm; PackageReference: 0805; Length: 2 mm; Min Operating Temperature: -55 degC; ComponentLink1URL: http://www.yageo.com/; Height: 0.5 mm; ComponentLink1Description: Manufacturer URL; ComponentLink2Description: Datasheet

## Sheet USB-HOST.SchDoc
size B
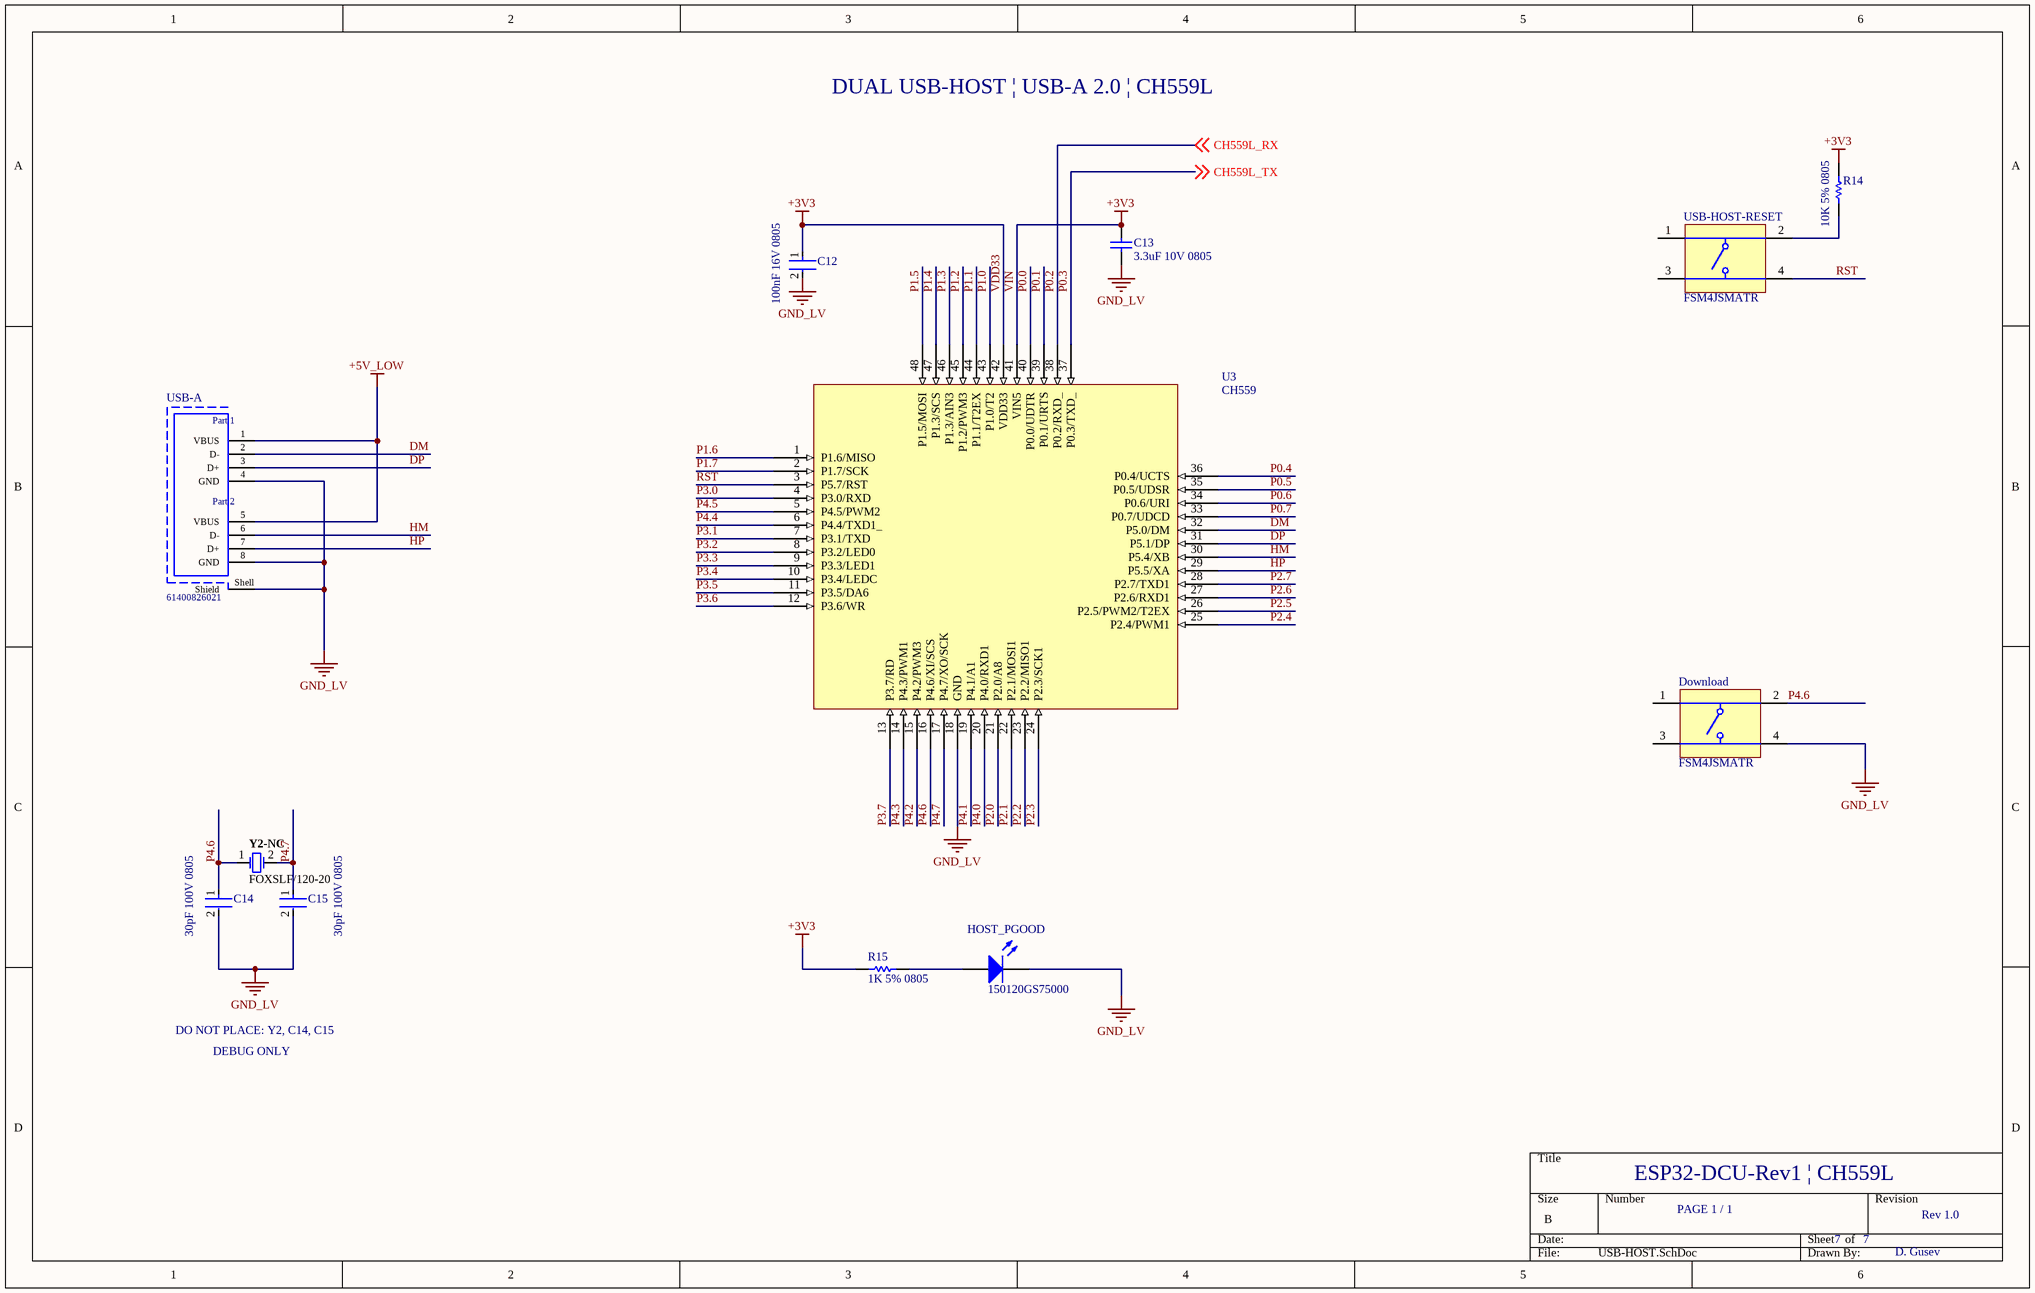
[diagram p2: USB-HOST.SchDoc]

### Parts
C12  100nF 16V 0805  [FP-C0805C-DN-MFG]
C13  3.3uF 10V 0805  [CAPC2013X140X50LL20T25]
C14  30pF 100V 0805  [FP-C0805C-DN-MFG]
C15  30pF 100V 0805  [FP-C0805C-DN-MFG]
Download  FSM4JSMATR  [TECO-FSM4JSMATR_V]
HOST_PGOOD  150120GS75000  [1206_A]
R14  10K 5% 0805  [RESC2013X60X40ML20T25]
R15  1K 5% 0805  [RESC2013X60X40ML20T25]
U3  CH559  [CH559L]
USB-A  61400826021  [61400826021]
USB-HOST-RESET  FSM4JSMATR  [TECO-FSM4JSMATR_V]
Y2-NC  FOXSLF/120-20  [FOX-FOXSLF-2_V]

### Nets
+5V_LOW: USB-A.1(VBUS) USB-A.5(VBUS)
GND_LV: C12.2 C13.1 C14.2 C15.2 Download.4 HOST_PGOOD.1(K) U3.18(GND) USB-A.4(GND) USB-A.8(GND) USB-A.Shell(Shield)
VDD33: C12.1 C13.2 R14.2 R15.2 U3.41(VIN5) U3.42(VDD33)  [also labelled +3V3, VIN]
CH559L_RX: U3.38(P0.2/RXD_) ; off-sheet CH559L_RX  [also labelled P0.2]  [project net GPIO17]
CH559L_TX: U3.37(P0.3/TXD_) ; off-sheet CH559L_TX  [also labelled P0.3]  [project net GPIO16]
DM: U3.32(P5.0/DM) USB-A.2(D-)
DP: U3.31(P5.1/DP) USB-A.3(D+)
HM: U3.30(P5.4/XB) USB-A.6(D-)
HP: U3.29(P5.5/XA) USB-A.7(D+)
P0.0: U3.40(P0.0/UDTR)
P0.1: U3.39(P0.1/URTS)
P0.4: U3.36(P0.4/UCTS)
P0.5: U3.35(P0.5/UDSR)
P0.6: U3.34(P0.6/URI)
P0.7: U3.33(P0.7/UDCD)
P1.0: U3.43(P1.0/T2)
P1.1: U3.44(P1.1/T2EX)
P1.2: U3.45(P1.2/PWM3)
P1.3: U3.46(P1.3/AIN3)
P1.4: U3.47(P1.3/SCS)
P1.5: U3.48(P1.5/MOSI)
P1.6: U3.1(P1.6/MISO)
P1.7: U3.2(P1.7/SCK)
P2.0: U3.21(P2.0/A8)
P2.1: U3.22(P2.1/MOSI1)
P2.2: U3.23(P2.2/MISO1)
P2.3: U3.24(P2.3/SCK1)
P2.4: U3.25(P2.4/PWM1)
P2.5: U3.26(P2.5/PWM2/T2EX)
P2.6: U3.27(P2.6/RXD1)
P2.7: U3.28(P2.7/TXD1)
P3.0: U3.4(P3.0/RXD)
P3.1: U3.7(P3.1/TXD)
P3.2: U3.8(P3.2/LED0)
P3.3: U3.9(P3.3/LED1)
P3.4: U3.10(P3.4/LEDC)
P3.5: U3.11(P3.5/DA6)
P3.6: U3.12(P3.6/WR)
P3.7: U3.13(P3.7/RD)
P4.0: U3.20(P4.0/RXD1)
P4.1: U3.19(P4.1/A1)
P4.2: U3.15(P4.2/PWM3)
P4.3: U3.14(P4.3/PWM1)
P4.4: U3.6(P4.4/TXD1_)
P4.5: U3.5(P4.5/PWM2)
P4.6: C14.1 Download.2 U3.16(P4.6/XI/SCS) Y2-NC.1
P4.7: C15.1 U3.17(P4.7/XO/SCK) Y2-NC.2
RST: U3.3(P5.7/RST) USB-HOST-RESET.4
NetHOST_PGOOD_2: HOST_PGOOD.2(A) R15.1
NetR14_1: R14.1 USB-HOST-RESET.2

Not connected (* = marked no-connect by the designer): Download 1 3; USB-HOST-RESET 1 3

### Notes on the sheet
- DUAL USB-HOST | USB-A 2.0 | CH559L
- DO NOT PLACE: Y2, C14, C15
- DEBUG ONLY
- ESP32-DCU-Rev1 | CH559L
- PAGE 1 / 1
- 7
- Rev 1.0
- D. Gusev
- (in symbol CMP-1502-03229-1) Part 1; Part 2

### Library data of the parts
C12 = CMP-2007-00279-2: as C1 on sheet USB-ESP32; Device Class L2: Capacitors; Temperature Range Low: -55°C; Voltage Rating: 50 V; Digikey Description: CAP CER 0.1UF 50V X7R 0805; Category: Cap; ComponentLink2Description: Datasheet; Octopart: https://octopart.com/c0805c104k5ractu-kemet-143926; RoHS: TRUE; ComponentLink2URL: https://content.kemet.com/datasheets/KEM_C1003_C0G_SMD.pdf; Temperature Characteristic: X7R; Temperature: -55°C to +125°C; Height: 0.88mm; Temperature Range High: +125°C; Device Class L1: Passive Components; Automotive: No; Lead Free: Yes; Ipc Land Pattern Name: CAPC200125X78; Device Class L3: Ceramic Capacitors; Mouser Description: Cap Ceramic 0.1uF 50V X7R 10% SMD 2.0 x 1.2 mm 125 C Paper T/R; Capacitance: 0.10 μF; Package: C0805C-DN
C13 = CMP-2007-04685-1: Part Number: 0805ZD335KAT2A; Manufacturer: AVX Interconnect / Elco
C14 C15 = CMP-2007-00448-2: CAP CER 22PF 100V 5% NP0 0805; Manufacturer Part Number: C0805C220J1GACTU; Manufacturer: KEMET; Material: Ceramic; Temperature Coefficient: 30ppm/°C; Tolerance: 0.05; Temperature Characteristic: C0G; Value: 22 pF; RoHS: TRUE; ComponentLink2URL: https://content.kemet.com/datasheets/KEM_C1003_C0G_SMD.pdf; Capacitance: 22 pF; Mouser Description: Multilayer Ceramic Capacitor, C Series, 22 Pf, - 5%, C0g / Np0, 100 V, 0805 [2012 Metric] Rohs Compliant: Yes; Digikey Description: CAP CER 22PF 100V 5% NP0 0805; Octopart: https://octopart.com/c0805c220j1gactu-kemet-3791395; Device Class L3: Ceramic Capacitors; Device Class L2: Capacitors; Voltage Rating: 100 V; Temperature Range Low: -55°C; Ipc Land Pattern Name: CAPC200125X78; Lead Free: Yes; ComponentLink2Description: Datasheet; Category: Cap; Temperature: -55°C to +125°C; Package: C0805C-DN; Device Class L1: Passive Components; Temperature Range High: +125°C; Height: 0.88mm; Automotive: No
Download USB-HOST-RESET = CMP-2000-07486-1: as ESP32-BOOT on sheet ESP32; Termination: GullWing; Contact Plating: Silver; Orientation: Straight; Mounting Technology: SurfaceMount; REACH SVHC: Unknown; Electrical Life: 100000Cycles; Package Reference: FSM4JSMATR; Max Operating Temperature: 85degC; Manufacturer URL: http://www.te.com/; Package Description: 4-Pin Surface Mount Device, Body 6 x 6 mm, Pitch 4.5 mm; Datasheet Version: Rev. V, 02/2015; Packaging: TapeandReel; Min Operating Temperature: -35degC; Mount: SurfaceMount; Contact Current Rating: 50mA; Contact Material: CopperAlloy; Package Quantity: 1200; Datasheet URL: http://www.te.com/commerce/DocumentDelivery/DDEController?Action=showdoc&DocId=Customer+Drawing%7F2-1437565-7%7FV%7Fpdf%7FEnglish%7FENG_CD_2-1437565-7_V.pdf%7F4-1437565-2; RoHSCompliant: true
HOST_PGOOD = CMP-1426-00014-1: as 3V3 on sheet USB-ESP32; PackageReference: 1206_A; PartNumber: 150120GS75000; ComponentLink1Description: Manufacturer URL; ComponentLink2URL: http://katalog.we-online.com/led/datasheet/150120GS75000.pdf; ComponentLink2Description: Datasheet; Color: Green; ComponentLink1URL: http://www.we-online.com
R14 R15 = CMP-2001-00590-1: as R1 on sheet USB-ESP32
U3 = CH559: DUAL USB-HOST 2.0
USB-A = CMP-1502-03229-1: USB 2.0 Type A Receptacle WR-COM, Stacked Horizontal, THT; Manufacturer: Wurth Elektronik; Contact Resistance: 20mOhm; Rated Current: 1.5A; Working Voltage: 30VAC; Connector Type: USB2.0TypeA; Packaging: Tray; Package Reference: 61400826021; Mounting Technology: THT; Datasheet URL: https://katalog.we-online.de/em/datasheet/61400826021.pdf; Operating Temperature: -40to105degC; Gender: Receptacle; Orientation: StackedHorizontal; Part Number: 61400826021; Publisher: WurthElektronik; Manufacturer URL: http://www.we-online.de
Y2-NC = CMP-1749-00004-1: Resistance Weld Thru-Hole Crystal, 12 MHz, +/-30 ppm, -20 to 70 degC, 2-Pin THD, RoHS, Bulk; Elements: 1; Rds On Max: 115 mohm; Typical Rise Time: 90 ns; Max Power Dissipation: 2.5 W; Case\Package: TO-251-3; Input Capacitance: 350 pF; REACH SVHC: No SVHC; Length: 6.6 mm; ComponentLink1URL: http://www.foxonline.com/; PackageDescription: 2-Pin Through Hole Device, Body 11.35 x 4.65 mm, Pitch 4.88 mm; Radiation Hardening: No; Package Quantity: 70; Packaging: Rail/Tube; ComponentLink1Description: Manufacturer URL; Min Operating Temperature: -55 degC; Max Operating Temperature: 150 degC; RoHSCompliant: true; PackageReference: FOXSLF-2; DatasheetVersion: Mar-15; Pins: 3; Height: 6.1 mm; Mount: Through Hole; ComponentLink2URL: http://www.foxonline.com/pdfs/hc49slf.pdf; ComponentLink2Description: Datasheet; Width: 2.3 mm

## Sheet Ethernet.SchDoc
size B
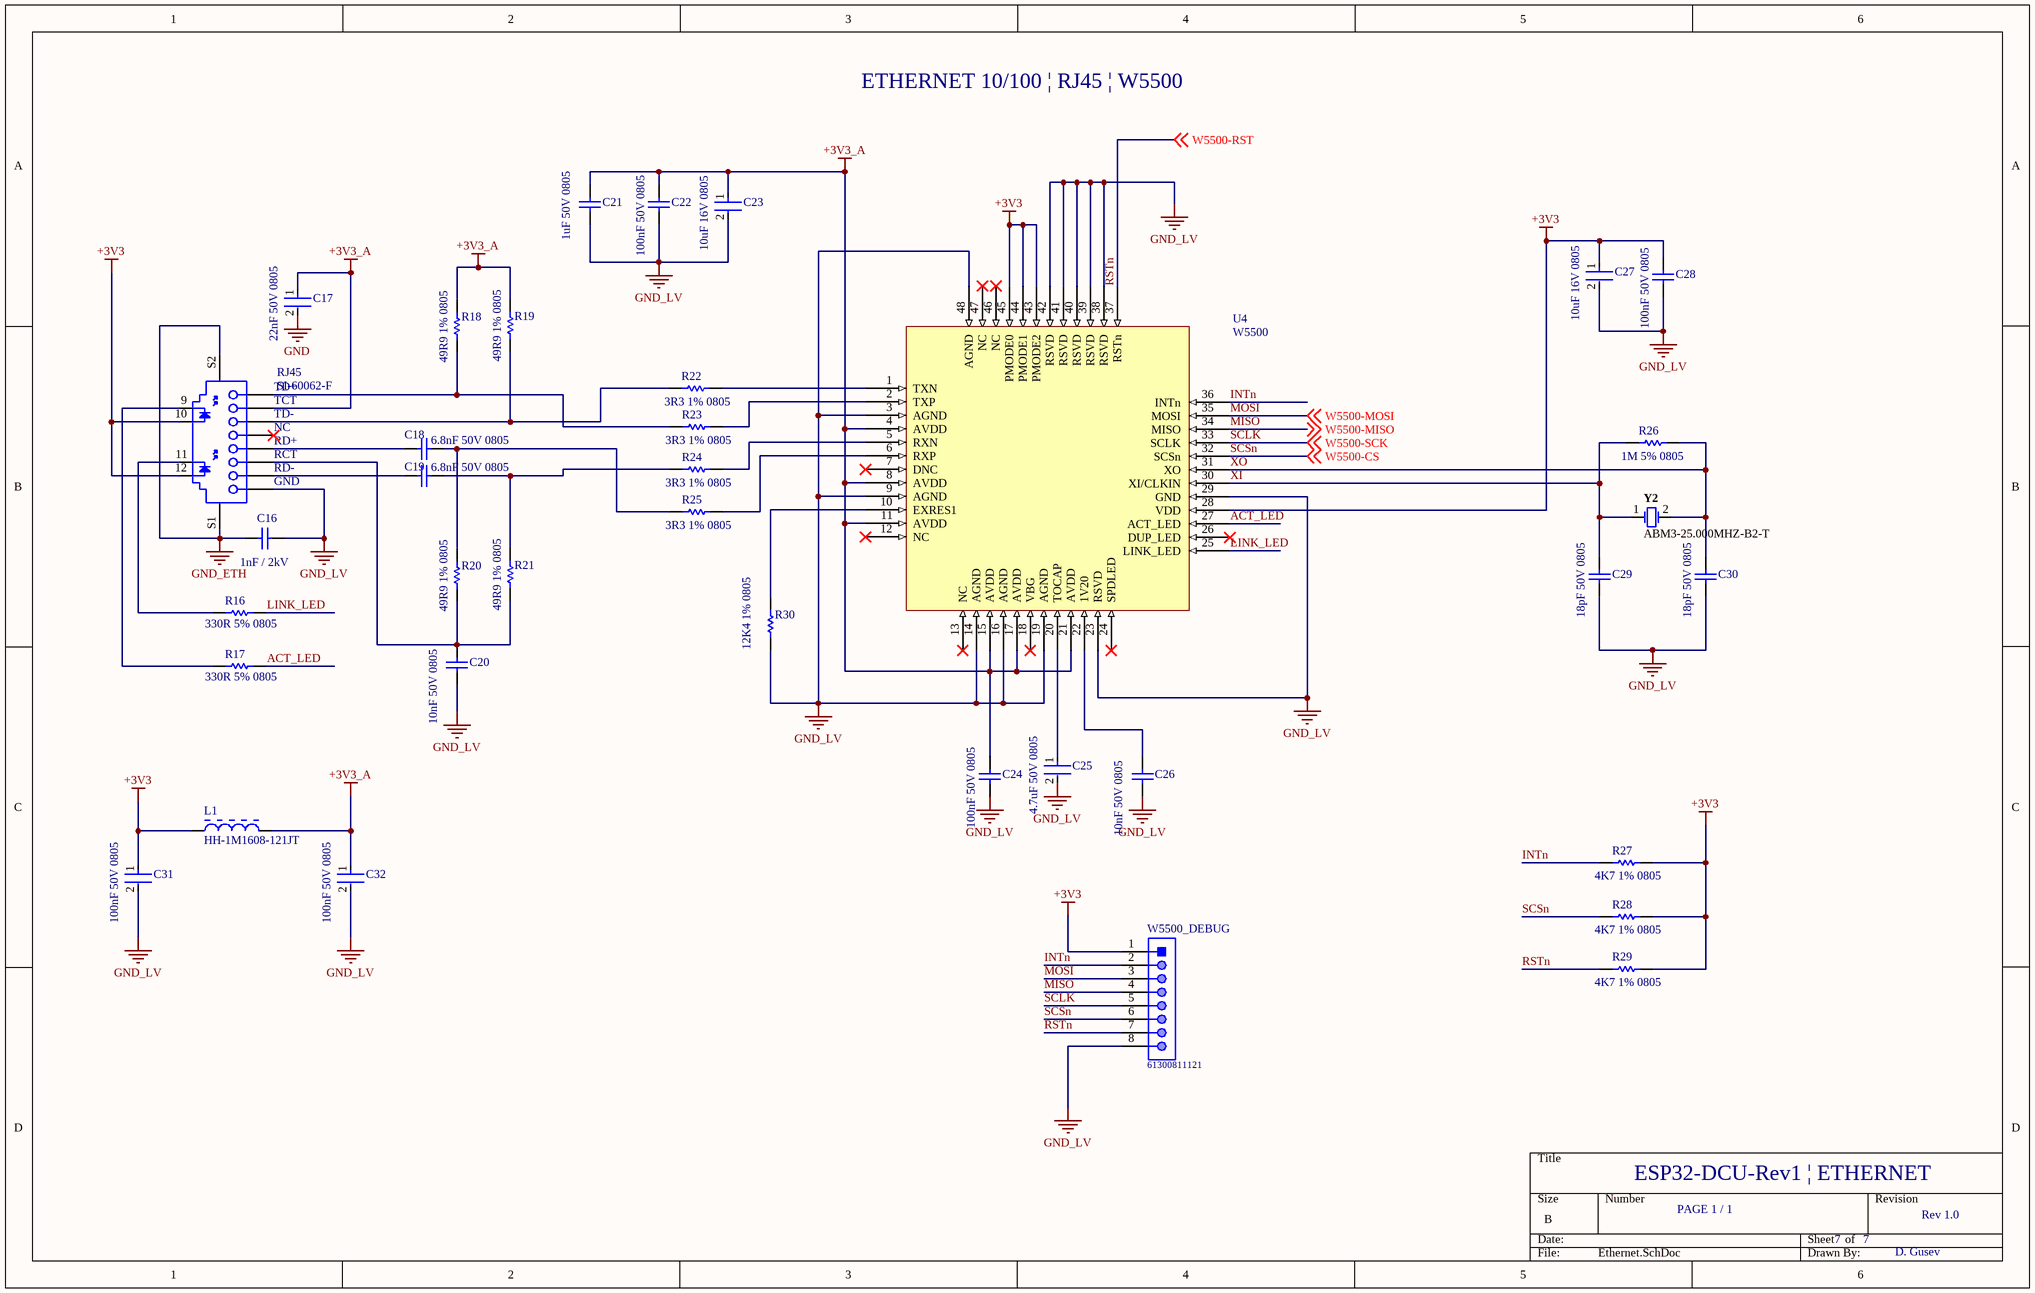
[diagram p3: Ethernet.SchDoc]

### Parts
(Parts that share a designator on the sheet are numbered #1, #2 ... from top to bottom, then left to right.)
C16  1nF / 2kV  [CAPC4532X155X60LL30T35]
C17  22nF 50V 0805  [FP-CL21-IPC_A]
C18  6.8nF 50V 0805  [CAPC2013X94X50NL20T25]
C19  6.8nF 50V 0805  [CAPC2013X94X50NL20T25]
C20  10nF 50V 0805  [CAPC2013X140X50NL20T25]
C21  1uF 50V 0805  [CAPC2013X135X45LL10T25]
C22  100nF 50V 0805  [CAPC2013X94X50ML20T25]
C23  10uF 16V 0805  [FP-GRM21B-0_1-IPC_C]
C24  100nF 50V 0805  [CAPC2013X94X50ML20T25]
C25  4.7uF 50V 0805  [FP-C2012-125-MFG]
C26  10nF 50V 0805  [CAPC2013X140X50NL20T25]
C27  10uF 16V 0805  [FP-GRM21B-0_1-IPC_C]
C28  100nF 50V 0805  [CAPC2013X94X50ML20T25]
C29  18pF 50V 0805  [CAPC2013X71X50LL20T25]
C30  18pF 50V 0805  [CAPC2013X71X50LL20T25]
C31  100nF 50V 0805  [FP-C0805C-DN-MFG]
C32  100nF 50V 0805  [FP-C0805C-DN-MFG]
L1#1  HH-1M1608-121JT  [CTC-1608_L]
R16  330R 5% 0805  [RESC2013X60X35LL10T20]
R17  330R 5% 0805  [RESC2013X60X35LL10T20]
R18  49R9 1% 0805  [RESC2013X60X40LL20T25]
R19  49R9 1% 0805  [RESC2013X60X40LL20T25]
R20  49R9 1% 0805  [RESC2013X60X40LL20T25]
R21  49R9 1% 0805  [RESC2013X60X40LL20T25]
R22  3R3 1% 0805  [RESC2013X70X40ML20T20]
R23  3R3 1% 0805  [RESC2013X70X40ML20T20]
R24  3R3 1% 0805  [RESC2013X70X40ML20T20]
R25  3R3 1% 0805  [RESC2013X70X40ML20T20]
R26  1M 5% 0805  [RESC2013X70X40NL20T20]
R27  4K7 1% 0805  [YAGO-RC0805_M]
R28  4K7 1% 0805  [YAGO-RC0805_M]
R29  4K7 1% 0805  [YAGO-RC0805_M]
R30  12K4 1% 0805  [RESC2013X60X35NL10T20]
RJ45  SI-60062-F  [BELF-SI-60062-F_V]
U4  W5500  [W5500]
W5500_DEBUG  61300811121  [61300811121]
Y2  ABM3-25.000MHZ-B2-T  [ABRA-ABM3_V]

### Nets
+3V3: C27.1 C28.2 C31.1 L1#1.1 R27.2 R28.2 R29.2 RJ45.10 RJ45.12 U4.28(VDD) U4.43(PMODE2) U4.44(PMODE1) U4.45(PMODE0) W5500_DEBUG.1  [project net VDD33]
+3V3_A: C17.1 C21.2 C22.2 C23.1 C24.2 C32.1 L1#1.2 R18.2 R19.2 RJ45.2(TCT) U4.4(AVDD) U4.8(AVDD) U4.11(AVDD) U4.15(AVDD) U4.17(AVDD) U4.21(AVDD)
GND: C17.2
GND_ETH: C16.1 RJ45.S1 RJ45.S2
GND_LV: C16.2 C20.1 C21.1 C22.1 C23.2 C24.1 C25.2 C26.1 C27.2 C28.1 C29.1 C30.1 C31.2 C32.2 R30.1 RJ45.8(GND) U4.3(AGND) U4.9(AGND) U4.14(AGND) U4.16(AGND) U4.19(AGND) U4.23(RSVD) U4.29(GND) U4.38(RSVD) U4.39(RSVD) U4.40(RSVD) U4.41(RSVD) U4.42(RSVD) U4.48(AGND) W5500_DEBUG.8
ACT_LED: R17.2 U4.27(ACT_LED)
INTn: R27.1 U4.36(INTn) W5500_DEBUG.2
LINK_LED: R16.2 U4.25(LINK_LED)
MISO: U4.34(MISO) W5500_DEBUG.4 ; off-sheet W5500-MISO  [also labelled W5500-MISO]  [project net GPIO19 / VSPI_MISO]
MOSI: U4.35(MOSI) W5500_DEBUG.3 ; off-sheet W5500-MOSI  [also labelled W5500-MOSI]  [project net GPIO23~{ }/ VSPI_MOSI]
RSTn: R29.1 U4.37(RSTn) W5500_DEBUG.7 ; off-sheet W5500-RST  [also labelled W5500-RST]  [project net GPIO27 / ADC2_CH7]
SCLK: U4.33(SCLK) W5500_DEBUG.5 ; off-sheet W5500-SCK  [also labelled W5500-SCK]  [project net GPIO18 / VSPI_SCK]
SCSn: R28.1 U4.32(SCSn) W5500_DEBUG.6 ; off-sheet W5500-CS  [also labelled W5500-CS]
XI: C29.2 R26.1 U4.30(XI/CLKIN) Y2.1
XO: C30.2 R26.2 U4.31(XO) Y2.2
NetC18_1: C18.1 RJ45.5(RD+)
NetC18_2: C18.2 R20.2 R25.1
NetC19_1: C19.1 RJ45.7(RD-)
NetC19_2: C19.2 R21.2 R24.1
NetC20_2: C20.2 R20.1 R21.1 RJ45.6(RCT)
NetC25_1: C25.1 U4.20(TOCAP)
NetC26_2: C26.2 U4.22(1V20)
NetR16_1: R16.1 RJ45.11
NetR17_1: R17.1 RJ45.9
NetR18_1: R18.1 R23.1 RJ45.1(TD+)
NetR19_1: R19.1 R22.1 RJ45.3(TD-)
NetR22_2: R22.2 U4.1(TXN)
NetR23_2: R23.2 U4.2(TXP)
NetR24_2: R24.2 U4.5(RXN)
NetR25_2: R25.2 U4.6(RXP)
NetR30_2: R30.2 U4.10(EXRES1)

Not connected (* = marked no-connect by the designer): RJ45 4(NC)*; U4 7(DNC)* 12(NC)* 13(NC)* 18(VBG)* 24(SPDLED)* 26(DUP_LED)* 46(NC)* 47(NC)*

### Notes on the sheet
- ETHERNET 10/100 | RJ45 | W5500
- ESP32-DCU-Rev1 | ETHERNET
- PAGE 1 / 1
- 7
- Rev 1.0
- D. Gusev

### Library data of the parts
C16 = CMP-2000-06032-1: Chip Capacitor, 1000 pF, +/- 10%, 2000 V, -55 to 125 degC, 1812 (4532 Metric), RoHS, Tape and Reel; Manufacturer: Kemet; Kits: 399-5086-ND-KITCERHI-VOLTAGECAPS; Catalog Drawings: ACTU_1812; Capacitance: 1000pF; Product Training Modules: CapacitorBasics-TypicalUsesforCapacitors; Online Catalog: X7RDielectricHighVoltage; Other Names: 399-3447-1; Temperature Coefficient: X7R; Voltage - Rated: 2000V(2kV); Family: CeramicCapacitors; Height - Seated (Max): -; Standard Package: 1; Size / Dimension: 0.177"Lx0.126"W(4.50mmx3.20mm); Datasheet URL: http://capacitoredge.kemet.com/capedge2/DataSheet/Datasheet-C1812C102KGRACTU.pdf?pn=C1812C102KGRACTU; Datasheet Version: 09/2016; Thickness (Max): 0.061"(1.55mm); Applications: SMPSFiltering; Package Description: 2-Pin Surface Mount Device, Body 4.5 x 3.2 mm; Package Reference: 1812; Mounting Technology: SurfaceMount; Packaging: CutTape(CT); Manufacturer URL: http://www.kemet.com/; Operating Temperature: -55°C~125°C; Mounting Type: SurfaceMount,MLCC; Features: HighVoltage; Package / Case: 1812(4532Metric); Lead Spacing: -; Tolerance: ±10%; Lead Style: -; Series: C; Category: Capacitors; Ratings: -
C17 = CMP-13271-002911-1: CL21 Series 0805 22nF 50V ±10% Tolerance X7R Multilayer Ceramic Chip Capacitor; Depth: 1.25mm; Thickness: 0.03inch; Height: 0.65mm; Material: Ceramic; Case/Package: 0805; Voltage Rating (DC): 50V; Contact Plating: Tin; Package Quantity: 1; Case Code (Metric): 2012; Max Operating Temperature: 125°C; Packaging: Tape and Reel; Voltage Rating: 50V; Radiation Hardening: No; Length: 2mm; Mount: Surface Mount; Min Operating Temperature: -55°C; Tolerance: 10%; Case Code (Imperial): 0805; Voltage: 50V; Capacitance: 22nF; Dielectric: X7R; Lead Free: Lead Free; Width: 0.049inch
C18 C19 = CMP-1036-03710-2: Manufacturer: AVX Interconnect / Elco; Part Number: 08055C682KAT2A
C20 C26 = CMP-2007-04596-1: Manufacturer: AVX Interconnect / Elco; Part Number: 08052C103KAT2A
C21 = CMP-1036-04761-2: Manufacturer: Murata; Part Number: GRM21BR71H105KA12L
C22 C24 C28 = CMP-2000-05016-1: Chip Capacitor, Ceramic, 0.1 uF, 10%, 50 V, 0805, RoHS, Tape and Reel; Manufacturer: AVX; Dielectric: X7R; Case Size/Dimension: 0805; Tolerance (%): ±10%; Rated Voltage: 50V; Capacitance: 100nF; Datasheet URL: http://www.farnell.com/datasheets/319609.pdf; Datasheet Version: Sep-07; Manufacturer URL: http://www.avx.com/
C23 C27 = CMP-2007-03453-2: Chip Multilayer Ceramic Capacitors for General Purpose, 0805, 10uF, X5R, 15%, 10%, 16V; Radiation Hardening: No; Thickness: 0.053inch; Voltage Rating (DC): 16V; Lead Free: Lead Free; Package Quantity: 1; Width: 1.25mm; Case Code (Imperial): 0805; Depth: 1.25mm; Packaging: Tape and Reel; Dielectric: X5R; Max Operating Temperature: 85°C; Tolerance: 10%; Voltage Rating: 16V; Voltage: 16V; Capacitance: 10uF; Height: 1.25mm; Case Code (Metric): 2012; Material: Ceramic; Mount: Surface Mount; Case/Package: 0805; REACH SVHC: No SVHC; Length: 2mm; Min Operating Temperature: -55°C; Termination: SMD/SMT
C25 = CMP-08246-000007-1: as C3 on sheet USB-ESP32; Mouser Description: Multilayer Ceramic Capacitors MLCC - SMD/SMT 0805 4.7uF 50volts X5R 10%; Category: Cap; Temperature Range High: +85°C; Digikey Description: CAP CER 4.7UF 50V X5R 0805; Voltage Rating: 50V; Device Class L1: Passive Components; Temperature Range Low: -55°C; Lead Free: Yes; ComponentLink2Description: Datasheet; Capacitance: 4.7uF; Octopart: https://octopart.com/c2012x5r1h475k125ab-tdk-25947720; Device Class L2: Capacitors; Value: 4.7uF; Temperature: -55°C to +85°C; ComponentLink2URL: https://product.tdk.com/info/en/catalog/datasheets/mlcc_commercial_general_en.pdf; RoHS: TRUE; Height: 1.45mm; Temperature Characteristic: X5R; Package: C2012-125; Device Class L3: Ceramic Capacitors; Automotive: No
C29 C30 = CMP-2007-04502-1: Manufacturer: AVX Interconnect / Elco; Part Number: 08055A180JAT2A
C31 C32 = CMP-2007-00279-2: as C1 on sheet USB-ESP32; Device Class L2: Capacitors; Temperature Range Low: -55°C; Voltage Rating: 50 V; Digikey Description: CAP CER 0.1UF 50V X7R 0805; Category: Cap; ComponentLink2Description: Datasheet; Octopart: https://octopart.com/c0805c104k5ractu-kemet-143926; RoHS: TRUE; ComponentLink2URL: https://content.kemet.com/datasheets/KEM_C1003_C0G_SMD.pdf; Temperature Characteristic: X7R; Temperature: -55°C to +125°C; Height: 0.88mm; Temperature Range High: +125°C; Device Class L1: Passive Components; Automotive: No; Lead Free: Yes; Ipc Land Pattern Name: CAPC200125X78; Device Class L3: Ceramic Capacitors; Mouser Description: Cap Ceramic 0.1uF 50V X7R 10% SMD 2.0 x 1.2 mm 125 C Paper T/R; Capacitance: 0.10 μF; Package: C0805C-DN
L1#1 = CMP-2000-06403-1: Chip Ferrite Bead, 0.14 Ohm, 1.1 A, -55 to 125 degC, 2-Pin SMD, RoHS, Tape and Reel; Manufacturer: CTC Coils; DC Resistance Max: 140MOhm; DC Current Max: 1.1A; Datasheet Version: 07/2004; Datasheet URL: http://data.icbank.com/ICBShop/board/beadhbm.pdf; PartNumber: HH-1M1608; Package Reference: 1608; Temperature Min: -55degC; Manufacturer URL: http://www.brokerforum.com/components-parts/CTCCoils-e-en.jsa; Mounting Technology: SurfaceMount; Temperature Max: 125degC; Package Description: 2-Pin Surface Mount Device, Body 1.6 x 0.8 mm; Packing: TapeandReel
R16 R17 = CMP-2000-06960-1: Chip Resistor, 330 Ohm, +/- 1%, 125 mW, -55 to 155 degC, 0805 (2012 Metric), RoHS, Tape and Reel; Manufacturer: Yageo; Voltage Rating: 150V; Temperature Coefficient: 100PPM/C; Power Rating: 125mW(1/8W); Resistance: 330Ohms; Datasheet Version: Rev. 7, 05/2017; Termination Style: SMD/SMT; Case Code - mm: 2012; Package Description: 2-Pin Surface Mounted Device, Body 2 x 1.25 mm; Operating Temperature Range: -55Cto+155C; Case Code - in: 0805; Packaging: Reel; Tolerance: 1%; Package Reference: 0805; Mounting Technology: SurfaceMount; Product: ThickFilmResistorsGeneralPurpose; Series: RC; Manufacturer URL: http://www.yageo.com/; Datasheet URL: http://www.yageo.com/documents/recent/PYu-RC_Group_51_RoHS_L_7.pdf
R18-R21 = CMP-2001-00841-1: Manufacturer: Panasonic; Part Number: ERA6AEB49R9V
R22-R25 = CMP-2001-00462-1: Part Number: ERJ-6RQF3R3V; Manufacturer: Panasonic
R26 = CMP-2001-04378-5: Chip Resistor, 1000 KOhm, +/- 1%, 0.125 W, -55 to 155 degC, 0805 (2012 Metric), RoHS, Tape and Reel; Manufacturer: Panasonic; Voltage Rating: 150 V; ComponentLink2URL: http://industrial.panasonic.com/cdbs/www-data/pdf/RDA0000/AOA0000C86.pdf; PackageReference: 0805; Min Operating Temperature: -55 degC; RoHSCompliant: true; Package Quantity: 5000; ComponentLink1URL: http://www.panasonic.com/; Pins: 2; Height: 0.6 mm; Packaging: Tape and Reel; ComponentLink2Description: Datasheet; ComponentLink1Description: Manufacturer URL; Mounting Technology: Surface Mount; REACH SVHC: Yes; Mount: Surface Mount; PackageDescription: 2-Pin Surface Mount Device, Body 2 x 1.25 mm; DatasheetVersion: 04/2015; Max Operating Temperature: 155 degC; Length: 2 mm
R27-R29 = CMP-1568-00001-1: General Puprose Chip Resistor, 4700 Ohm +/- 1%, 0.125 W, -55 to 155 degC, 2-Pin SMD, RoHS, Tape and Reel; PartNumber: RC0805FR-074K7L; Tolerance: +/- 1%; Power: 0.125 W; PackageDescription: 2-Pin Surface Mount Device, Body 2 x 1.25 mm; ComponentLink2URL: http://www.yageo.com/documents/recent/PYu-RC_Group_51_RoHS_L-3.pdf; Temperature Min: -55 degC; Packing: Tape and Reel; Mounting Technology: Surface Mount; ComponentLink1URL: http://www.yageo.com/NewPortal/_en/index.jsp; Resistance: 4700 Ohm; Temperature Max: 155 degC; ComponentLink2Description: Datasheet; DatasheetVersion: Rev. 3; RoHS: TRUE; ComponentLink1Description: Manufacturer URL
R30 = CMP-2001-00911-1: Part Number: RC0805FR-0712K4L; Manufacturer: Yageo
RJ45 = CMP-2000-07059-1: 1 Port RJ45 Magjack Connector with Yellow and Green LED, 10/100 Base-T, 12-Pin THD, RoHS, Tray; Manufacturer: Bel Fuse; Number of Ways: 8P4C; Gender: Female; Shield Type: STP; Connector Type: RJ45; Contact Plating: Gold; Mounting Type: ThroughHole; Datasheet Version: Rev. B0, 09/2008; Package Reference: SI-60062-F; Manufacturer URL: http://belfuse.com/; Package Description: 12-Pin Through Hole Device, Body 21.59 x 16.13 mm; Series: MagJack; Contact Material: CopperAlloy; Datasheet URL: http://belfuse.com/pdfs/SI-60062-F.pdf; Width: 17.98mm; Length: 15.21mm; Mounting Technology: ThroughHole; Depth: 21.59mm; Orientation: Straight
U4 = W5500: W5500 10/100 ETHERNET
W5500_DEBUG = CMP-1502-01076-1: THT Vertical Pin Header WR-PHD, Pitch 2.54 mm, Single Row, 8 pins; Manufacturer: Wurth Elektronik; Rated Current: 3A; Pin Number: 8; Working Voltage: 250VAC; Gender: Male; Contact Resistance: 20mOhm; Pitch: 2.54mm; Withstanding Voltage: 500VAC; Publisher: WurthElektronik; Operating Temperature: -40to105degC; Orientation: Vertical; Row Number: Single; Part Number: 61300811121; Package Reference: 61300811121; Mounting Technology: THT; Packaging: Bag; Manufacturer URL: http://www.we-online.de; Datasheet URL: https://katalog.we-online.de/em/datasheet/6130xx11121.pdf
Y2 = CMP-2000-05729-1: Miniature Ceramic Crystal, 25 MHz, +/- 20 ppm, -20 to 70 degC, 2-Pin SMD, RoHS, Tape and Reel; Manufacturer: ABRACON; Case Height: 1.3mm; Tolerance: 20PPM; Load Capacitance: 18pF; Frequency: 25MHz; ESR: 30Ohms; Frequency Stability: 50PPM; Case Width: 3.2mm; Case Length: 5mm; Packaging: Reel; Package Description: 2-Pin Surface Mount Device, Body 5 x 3.2 mm; Manufacturer URL: http://www.abracon.com/; Mounting Technology: SurfaceMount; RoHS: Details; Operating Temperature Range: -20Cto+70C; Datasheet URL: http://www.abracon.com/Resonators/abm3.pdf; Type: MiniatureCeramicCrystal; Series: ABM3; Product Category: Crystals; Factory Pack Quantity: 1000; Mounting Style: SMD/SMT; Brand: ABRACON; Datasheet Version: 09/2013; Dimensions: 3.2mmWx5mmLx1.3mmH; Termination Style: SMD/SMT; Package Reference: ABM3; Package / Case: 5mmx3.2mm

## Sheet MCP23017.SchDoc
size B
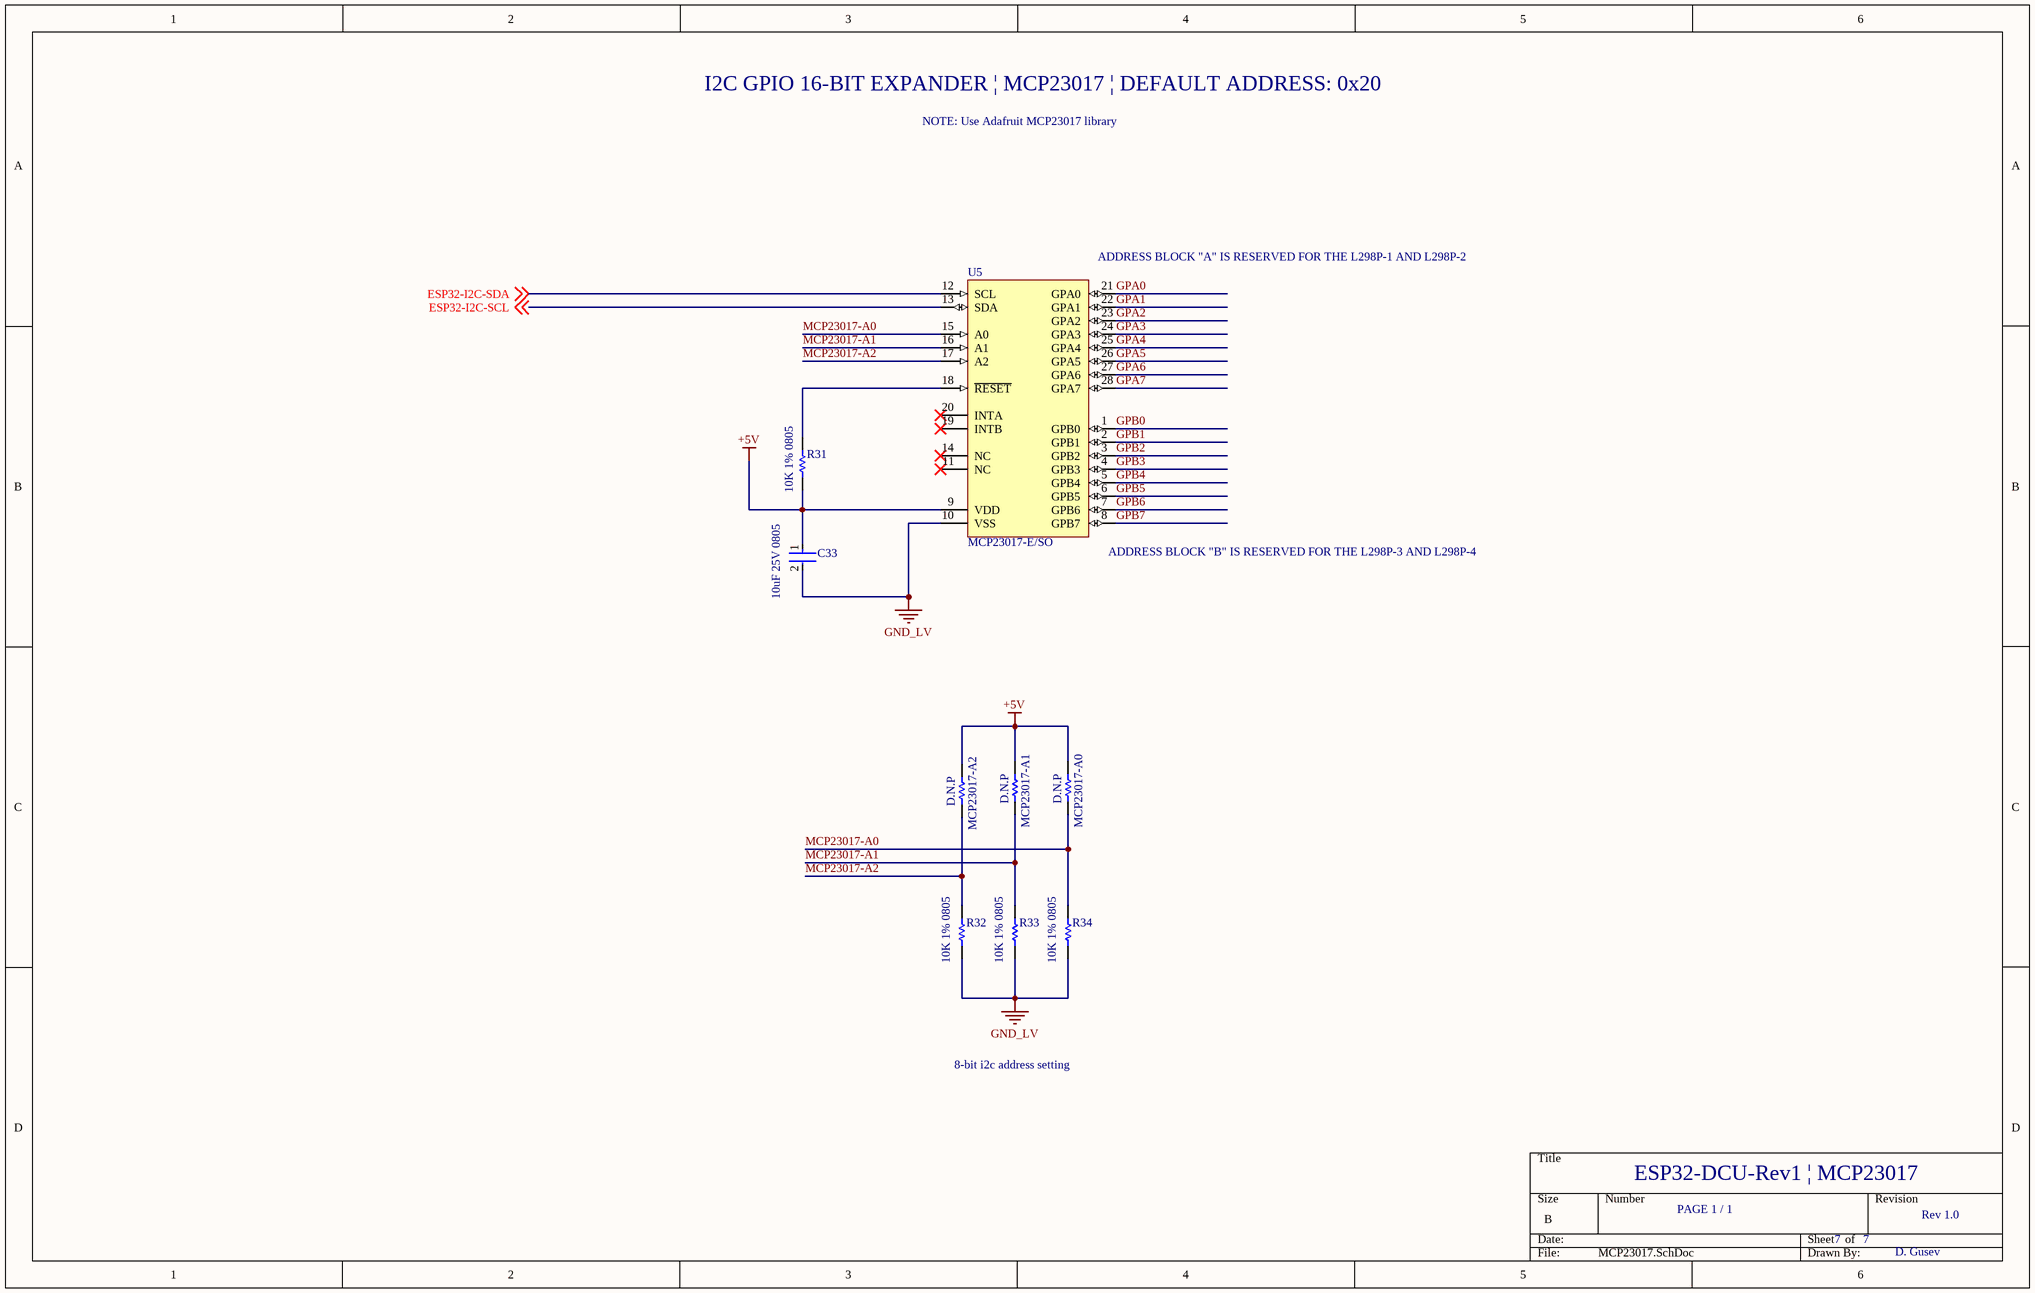
[diagram p4: MCP23017.SchDoc]

### Parts
C33  10uF 25V 0805  [FP-GRM21B-0_15-IPC_B]
MCP23017-A0  D.N.P  [RESC2013X60X35LL10T20]
MCP23017-A1  D.N.P  [RESC2013X60X35LL10T20]
MCP23017-A2  D.N.P  [RESC2013X60X35LL10T20]
R31  10K 1% 0805  [RESC2013X60X35ML10T20]
R32  10K 1% 0805  [RESC2013X60X35ML10T20]
R33  10K 1% 0805  [RESC2013X60X35ML10T20]
R34  10K 1% 0805  [RESC2013X60X35ML10T20]
U5  MCP23017-E/SO  [SOIC-SO28_N]

### Nets
+5V: C33.1 MCP23017-A0.2 MCP23017-A1.2 MCP23017-A2.2 R31.1 U5.9(VDD)
GND_LV: C33.2 R32.2 R33.2 R34.2 U5.10(VSS)
ESP32-I2C-SCL: U5.13(SDA) ; off-sheet ESP32-I2C-SCL  [project net GPIO22 / SCL]
ESP32-I2C-SDA: U5.12(SCL) ; off-sheet ESP32-I2C-SDA  [project net GPIO21 / SDA]
GPA0: U5.21(GPA0)
GPA1: U5.22(GPA1)
GPA2: U5.23(GPA2)
GPA3: U5.24(GPA3)
GPA4: U5.25(GPA4)
GPA5: U5.26(GPA5)
GPA6: U5.27(GPA6)
GPA7: U5.28(GPA7)
GPB0: U5.1(GPB0)
GPB1: U5.2(GPB1)
GPB2: U5.3(GPB2)
GPB3: U5.4(GPB3)
GPB4: U5.5(GPB4)
GPB5: U5.6(GPB5)
GPB6: U5.7(GPB6)
GPB7: U5.8(GPB7)
MCP23017-A0: MCP23017-A0.1 R34.1 U5.15(A0)
MCP23017-A1: MCP23017-A1.1 R33.1 U5.16(A1)
MCP23017-A2: MCP23017-A2.1 R32.1 U5.17(A2)
NetR31_2: R31.2 U5.18(~{RESET})

Not connected (* = marked no-connect by the designer): U5 11(NC)* 14(NC)* 19(INTB)* 20(INTA)*

### Notes on the sheet
- I2C GPIO 16-BIT EXPANDER | MCP23017 | DEFAULT ADDRESS: 0x20
- NOTE: Use Adafruit MCP23017 library
- (near U5) ADDRESS BLOCK "A" IS RESERVED FOR THE L298P-1 AND L298P-2
- (near U5) ADDRESS BLOCK "B" IS RESERVED FOR THE L298P-3 AND L298P-4
- 8-bit i2c address setting
- ESP32-DCU-Rev1 | MCP23017
- PAGE 1 / 1
- 7
- Rev 1.0
- D. Gusev

### Library data of the parts
C33 = CMP-2007-03541-2: Chip Multilayer Ceramic Capacitors for General Purpose, 0805, 10uF, X5R, 15%, 10%, 25V; Length: 2mm; Depth: 1.25mm; Termination: SMD/SMT; Voltage: 25V; Height: 1.25mm; Material: Ceramic; Thickness: 0.053inch; Radiation Hardening: No; Min Operating Temperature: -55°C; Width: 0.049inch; Package Quantity: 1; Mount: Surface Mount; Dielectric: X5R; Packaging: Tape and Reel; Capacitance: 10uF; Voltage Rating (DC): 25V; Lead Free: Lead Free; Max Operating Temperature: 85°C; Case Code (Imperial): 0805; Case/Package: 0805; Tolerance: 10%; Voltage Rating: 25V; Case Code (Metric): 2012
MCP23017-A0-MCP23017-A2 = CMP-1659-00014-4: as VSPI-CS-5 on sheet ESP32; REACH SVHC: No SVHC; Mounting Technology: Surface Mount; RoHSCompliant: true; Packaging: Tape and Reel; ComponentLink2URL: http://www.yageo.com/documents/recent/PYu-RC_Group_51_RoHS_L_04.pdf; Pins: 2; Package Quantity: 5000; DatasheetVersion: Rev. 4, 02/2016; Mount: Surface Mount; Max Operating Temperature: 155 degC; PackageDescription: 2-Pin Surface Mounted Device, Body 2 x 1.25 mm; PackageReference: 0805; Length: 2 mm; Min Operating Temperature: -55 degC; ComponentLink1URL: http://www.yageo.com/; Height: 0.5 mm; ComponentLink1Description: Manufacturer URL; ComponentLink2Description: Datasheet
R31-R34 = CMP-2000-05025-1: Chip Resistor, 10 KOhm, +/- 5%, 0.125 W, -55 to 155 degC, 0805 (2012 Metric), RoHS, Tape and Reel; Manufacturer: Yageo; Resistor Element Type: ThickFilm; Voltage Rating: 150V; Product Range: RCSeries; SVHC: ToBeAdvised; Resistor Case Style: 0805[2012Metric]; Temperature Coefficient: ±100ppm/degC; Power Rating: 250mW; Resistance: 10kohm; Automotive Qualification Standard: -; Datasheet Version: REV. 2, 09/2004; Packaging: CutTape; Resistance Tolerance: ±5%; MSL: MSL1-Unlimited; Manufacturer URL: http://www.yageo.com/; Datasheet URL: http://www.yageo.ru/pdf/RC0805.pdf; Package Description: 2-Pin Surface Mounted Device, Body 2 x 1.25 mm; Package Reference: 805
U5 = CMP-0186-00161-2: 16-Bit I/O Expander with Serial Interface, 28-Pin SOIC, Extended Temperature; PackageReference: SOIC-SO28; ComponentLink2URL: http://ww1.microchip.com/downloads/en/DeviceDoc/21952b.pdf; PackageVersion: revBB, Aug-2009; ComponentLink1URL: http://www.microchip.com/; Code_JEDEC: MS-013; ComponentLink2Description: Datasheet; DatasheetVersion: revB, Feb-2007; PackageDescription: 28-Lead Plastic Small Outline (SO) - Wide 7.50mm Body [SOIC]; ComponentLink3Description: Package Specification; ComponentLink1Description: Manufacturer URL; RevisionNote: URLs added.; ComponentLink3URL: http://www.microchip.com/stellent/groups/techpub_sg/documents/packagingspec/en012702.pdf